# Altium project Arduino - FPGA Development Board.PrjPcb (part 1 of 2)
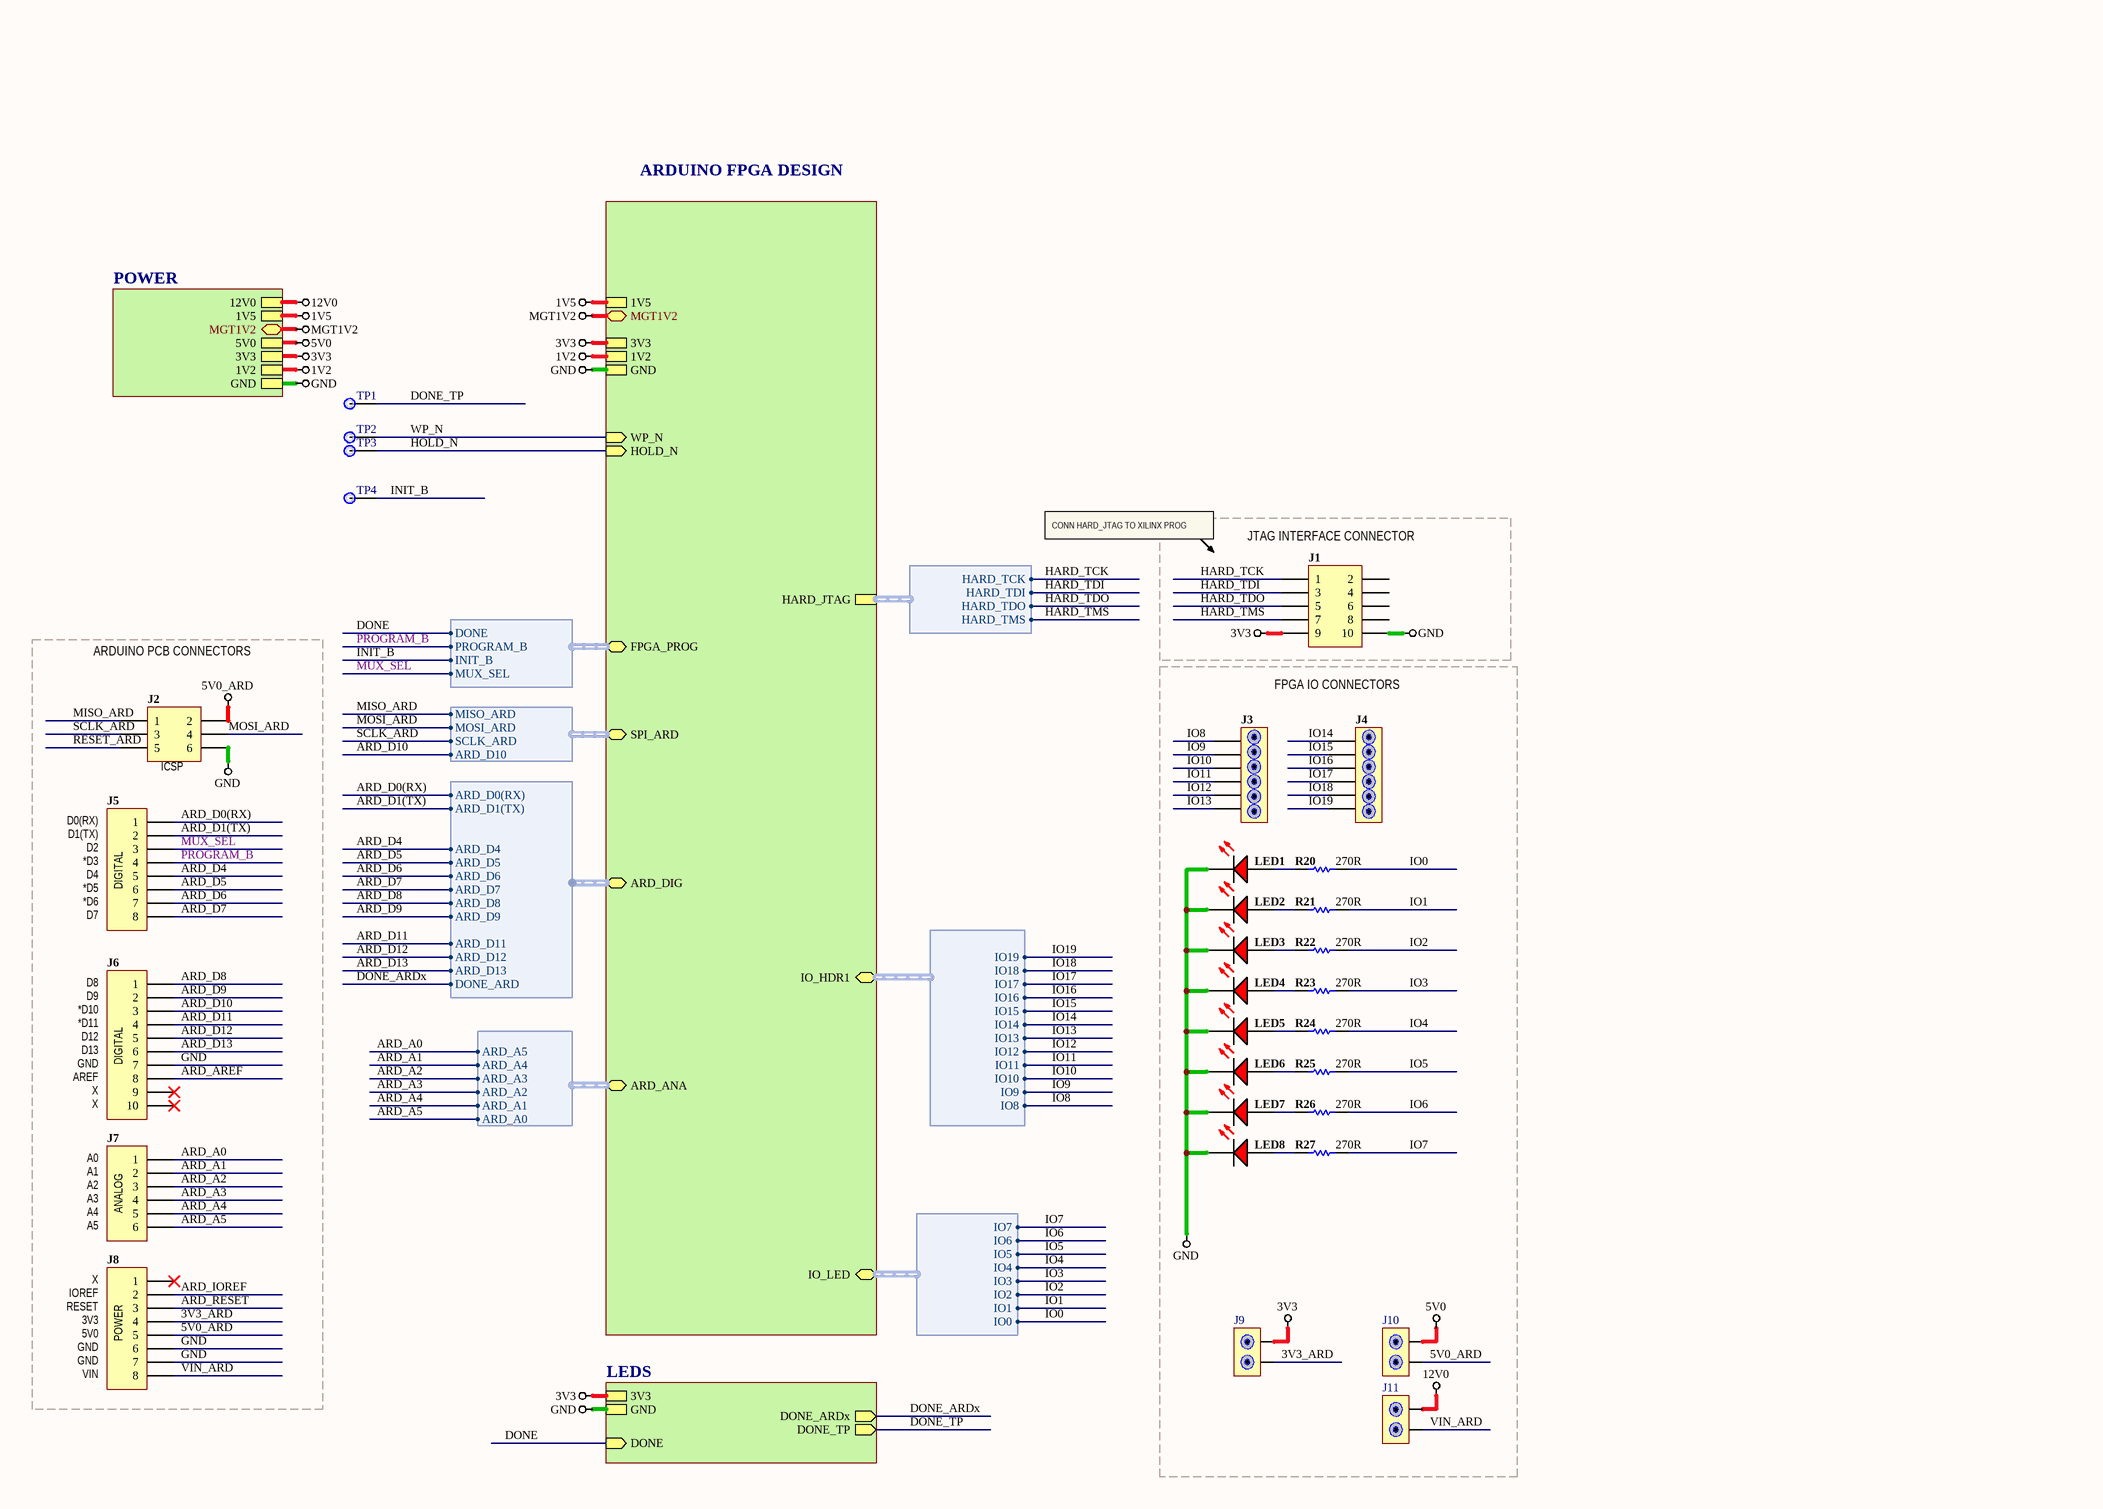
[diagram p0: Arduino FPGA Top-Level Interface.SchDoc]
15 sheets, 162 parts. Net scope: global (net labels, ports and power ports of the same name join across sheets).
Board file: Arduino_FPGA_Shield.PcbDoc
Sheets:
  Arduino FPGA Top-Level Interface.SchDoc
    ARDUINO FPGA DESIGN = Arduino FPGA Design.SchDoc
      FLASH_MEMORY = Flash - M25P32-VMW6TG.SchDoc
      FPGA_SUBSYSTEM = FPGA - XC6SLX45T-2CSG324C.schdoc
        U_FPGA - Decoupling = FPGA - Decoupling.SchDoc
      SPI MUX = Arduino FPGA SPI MUX.SchDoc
      SRAM = SRAM0 - IS61WV12816DBLL-10BLI.SchDoc
      MINI-PCIE = PCIE - mini-pcie-connector.SchDoc
      Designator = GPS - NEO-M8T.SchDoc
    POWER = Power.SchDoc
      Power - 5V0 = Power - 5V0.SchDoc
      Designator = Power - 3V3.SchDoc
      Designator = Power - MGT1V2.SchDoc
      Designator = Power - 1V5.SchDoc
    LEDS = LEDS - Status.SchDoc

## Sheet Arduino FPGA Top-Level Interface.SchDoc
size A3

### Parts
J1  Header 5X2  [HDR2X5]  (value not drawn)
J2  Header 3X2  [2X03]  (value not drawn)
J3  6-POS VERTICAL HEADER  [HDR1X6]  (value not drawn)
J4  6-POS VERTICAL HEADER  [HDR1X6]  (value not drawn)
J5  Header 8  [1X08]  (value not drawn)
J6  Header 10  [1X10@1]  (value not drawn)
J7  Header 6  [1X06]  (value not drawn)
J8  Header 8  [1X08]  (value not drawn)
J9  Jumper  [JMP1X2]  (value not drawn)
J10  Jumper  [JMP1X2]  (value not drawn)
J11  Jumper  [JMP1X2]  (value not drawn)
LED1  0402-LED-RED  [LED_0402]  (value not drawn)
LED2  0402-LED-RED  [LED_0402]  (value not drawn)
LED3  0402-LED-RED  [LED_0402]  (value not drawn)
LED4  0402-LED-RED  [LED_0402]  (value not drawn)
LED5  0402-LED-RED  [LED_0402]  (value not drawn)
LED6  0402-LED-RED  [LED_0402]  (value not drawn)
LED7  0402-LED-RED  [LED_0402]  (value not drawn)
LED8  0402-LED-RED  [LED_0402]  (value not drawn)
R20  value 270R  [RESC0402(1005)40_L]  (hidden comment: 270R 1 0402)
R21  value 270R  [RESC0402(1005)40_L]  (hidden comment: 270R 1 0402)
R22  value 270R  [RESC0402(1005)40_L]  (hidden comment: 270R 1 0402)
R23  value 270R  [RESC0402(1005)40_L]  (hidden comment: 270R 1 0402)
R24  value 270R  [RESC0402(1005)40_L]  (hidden comment: 270R 1 0402)
R25  value 270R  [RESC0402(1005)40_L]  (hidden comment: 270R 1 0402)
R26  value 270R  [RESC0402(1005)40_L]  (hidden comment: 270R 1 0402)
R27  value 270R  [RESC0402(1005)40_L]  (hidden comment: 270R 1 0402)
TP1  TESTPOINT_TH  [TESTPOINT_TH]  (value not drawn)
TP2  TESTPOINT_TH  [TESTPOINT_TH]  (value not drawn)
TP3  TESTPOINT_TH  [TESTPOINT_TH]  (value not drawn)
TP4  TESTPOINT_TH  [TESTPOINT_TH]  (value not drawn)

### Blocks framed on the sheet
JTAG INTERFACE CONNECTOR: J1
ARDUINO PCB CONNECTORS: J2 J5-J8
FPGA IO CONNECTORS: J3 J4 J9-J11 LED1-LED8 R20-R27

### Sub-sheets
ARDUINO FPGA DESIGN = Arduino FPGA Design.SchDoc: 3V3, GND, 1V2, HARD_JTAG (harness HARD_JTAG), WP_N (in), HOLD_N (in), FPGA_PROG (harness FPGA_PROGRAM), SPI_ARD (harness SPI_ARD), ARD_DIG (harness ARD_DIG), MGT1V2, 1V5, ARD_ANA (harness ARD_ANA), IO_HDR1 (harness IO_HDR1), IO_LED (harness IO_LED)
LEDS = LEDS - Status.SchDoc: GND, DONE (in), DONE_ARDx (out), DONE_TP (out), 3V3
POWER = Power.SchDoc: 5V0, 3V3, 1V2, GND, 1V5, MGT1V2, 12V0

### Harnesses
HARD_JTAG: HARD_TCK, HARD_TDI, HARD_TDO, HARD_TMS
FPGA_PROGRAM: INIT_B, PROGRAM_B, DONE, MUX_SEL
SPI_ARD: MISO_ARD, MOSI_ARD, SCLK_ARD, ARD_D10
ARD_DIG: ARD_D0(RX), ARD_D1(TX), ARD_D4, ARD_D5, ARD_D6, ARD_D7, ARD_D8, ARD_D9, ARD_D11, ARD_D12, ARD_D13, DONE_ARD
ARD_ANA: ARD_A0, ARD_A1, ARD_A2, ARD_A3, ARD_A4, ARD_A5
IO_LED: IO0, IO1, IO2, IO3, IO4, IO5, IO6, IO7
IO_HDR1: IO12, IO13, IO16, IO17, IO18, IO19, IO14, IO15, IO8, IO9, IO10, IO11

### Nets
1V2: sheet ARDUINO FPGA DESIGN/1V2, sheet POWER/1V2
1V5: sheet ARDUINO FPGA DESIGN/1V5, sheet POWER/1V5
3V3: J1.9 J9.2 ; sheet ARDUINO FPGA DESIGN/3V3, sheet POWER/3V3, sheet LEDS/3V3
5V0: J10.2 ; sheet POWER/5V0
5V0_ARD: J8.5 J10.1
12V0: J11.2 ; sheet POWER/12V0
GND: J1.10 J2.6 J6.7 J8.6 J8.7 LED1.2(K) LED2.2(K) LED3.2(K) LED4.2(K) LED5.2(K) LED6.2(K) LED7.2(K) LED8.2(K) ; sheet ARDUINO FPGA DESIGN/GND, sheet POWER/GND, sheet LEDS/GND  [project net AGND]
MGT1V2: sheet ARDUINO FPGA DESIGN/MGT1V2, sheet POWER/MGT1V2
3V3_ARD: J8.4 J9.1
ARD_A0: J7.1 ; sheet ARDUINO FPGA DESIGN/ARD_ANA.ARD_A5
ARD_A1: J7.2 ; sheet ARDUINO FPGA DESIGN/ARD_ANA.ARD_A4
ARD_A2: J7.3 ; sheet ARDUINO FPGA DESIGN/ARD_ANA.ARD_A3
ARD_A3: J7.4 ; sheet ARDUINO FPGA DESIGN/ARD_ANA.ARD_A2
ARD_A4: J7.5 ; sheet ARDUINO FPGA DESIGN/ARD_ANA.ARD_A1
ARD_A5: J7.6 ; sheet ARDUINO FPGA DESIGN/ARD_ANA.ARD_A0
ARD_AREF: J6.8
ARD_D0(RX): J5.1 ; sheet ARDUINO FPGA DESIGN/ARD_DIG.ARD_D0(RX)
ARD_D1(TX): J5.2 ; sheet ARDUINO FPGA DESIGN/ARD_DIG.ARD_D1(TX)
ARD_D4: J5.5 ; sheet ARDUINO FPGA DESIGN/ARD_DIG.ARD_D4
ARD_D5: J5.6 ; sheet ARDUINO FPGA DESIGN/ARD_DIG.ARD_D5
ARD_D6: J5.7 ; sheet ARDUINO FPGA DESIGN/ARD_DIG.ARD_D6
ARD_D7: J5.8 ; sheet ARDUINO FPGA DESIGN/ARD_DIG.ARD_D7
ARD_D8: J6.1 ; sheet ARDUINO FPGA DESIGN/ARD_DIG.ARD_D8
ARD_D9: J6.2 ; sheet ARDUINO FPGA DESIGN/ARD_DIG.ARD_D9
ARD_D10: J6.3 ; sheet ARDUINO FPGA DESIGN/SPI_ARD.ARD_D10
ARD_D11: J6.4 ; sheet ARDUINO FPGA DESIGN/ARD_DIG.ARD_D11
ARD_D12: J6.5 ; sheet ARDUINO FPGA DESIGN/ARD_DIG.ARD_D12
ARD_D13: J6.6 ; sheet ARDUINO FPGA DESIGN/ARD_DIG.ARD_D13
ARD_IOREF: J8.2
ARD_RESET: J8.3
DONE: sheet LEDS/DONE, sheet ARDUINO FPGA DESIGN/FPGA_PROG.DONE
DONE_ARDx: sheet LEDS/DONE_ARDx, sheet ARDUINO FPGA DESIGN/ARD_DIG.DONE_ARD
DONE_TP: TP1.1 ; sheet LEDS/DONE_TP
HARD_TCK: J1.1 ; sheet ARDUINO FPGA DESIGN/HARD_JTAG.HARD_TCK
HARD_TDI: J1.3 ; sheet ARDUINO FPGA DESIGN/HARD_JTAG.HARD_TDI
HARD_TDO: J1.5 ; sheet ARDUINO FPGA DESIGN/HARD_JTAG.HARD_TDO
HARD_TMS: J1.7 ; sheet ARDUINO FPGA DESIGN/HARD_JTAG.HARD_TMS
HOLD_N: TP3.1 ; sheet ARDUINO FPGA DESIGN/HOLD_N
INIT_B: TP4.1 ; sheet ARDUINO FPGA DESIGN/FPGA_PROG.INIT_B
IO0: R20.2 ; sheet ARDUINO FPGA DESIGN/IO_LED.IO0
IO1: R21.2 ; sheet ARDUINO FPGA DESIGN/IO_LED.IO1
IO2: R22.2 ; sheet ARDUINO FPGA DESIGN/IO_LED.IO2
IO3: R23.2 ; sheet ARDUINO FPGA DESIGN/IO_LED.IO3
IO4: R24.2 ; sheet ARDUINO FPGA DESIGN/IO_LED.IO4
IO5: R25.2 ; sheet ARDUINO FPGA DESIGN/IO_LED.IO5
IO6: R26.2 ; sheet ARDUINO FPGA DESIGN/IO_LED.IO6
IO7: R27.2 ; sheet ARDUINO FPGA DESIGN/IO_LED.IO7
IO8: J3.1 ; sheet ARDUINO FPGA DESIGN/IO_HDR1.IO8
IO9: J3.2 ; sheet ARDUINO FPGA DESIGN/IO_HDR1.IO9
IO10: J3.3 ; sheet ARDUINO FPGA DESIGN/IO_HDR1.IO10
IO11: J3.4 ; sheet ARDUINO FPGA DESIGN/IO_HDR1.IO11
IO12: J3.5 ; sheet ARDUINO FPGA DESIGN/IO_HDR1.IO12
IO13: J3.6 ; sheet ARDUINO FPGA DESIGN/IO_HDR1.IO13
IO14: J4.1 ; sheet ARDUINO FPGA DESIGN/IO_HDR1.IO14
IO15: J4.2 ; sheet ARDUINO FPGA DESIGN/IO_HDR1.IO15
IO16: J4.3 ; sheet ARDUINO FPGA DESIGN/IO_HDR1.IO16
IO17: J4.4 ; sheet ARDUINO FPGA DESIGN/IO_HDR1.IO17
IO18: J4.5 ; sheet ARDUINO FPGA DESIGN/IO_HDR1.IO18
IO19: J4.6 ; sheet ARDUINO FPGA DESIGN/IO_HDR1.IO19
MISO_ARD: J2.1 ; sheet ARDUINO FPGA DESIGN/SPI_ARD.MISO_ARD
MOSI_ARD: J2.4 ; sheet ARDUINO FPGA DESIGN/SPI_ARD.MOSI_ARD
MUX_SEL: J5.3 ; sheet ARDUINO FPGA DESIGN/FPGA_PROG.MUX_SEL
PROGRAM_B: J5.4 ; sheet ARDUINO FPGA DESIGN/FPGA_PROG.PROGRAM_B
RESET_ARD: J2.5
SCLK_ARD: J2.3 ; sheet ARDUINO FPGA DESIGN/SPI_ARD.SCLK_ARD
VIN_ARD: J8.8 J11.1
WP_N: TP2.1 ; sheet ARDUINO FPGA DESIGN/WP_N
NetLED1_1: LED1.1(A) R20.1
NetLED2_1: LED2.1(A) R21.1
NetLED3_1: LED3.1(A) R22.1
NetLED4_1: LED4.1(A) R23.1
NetLED5_1: LED5.1(A) R24.1
NetLED6_1: LED6.1(A) R25.1
NetLED7_1: LED7.1(A) R26.1
NetLED8_1: LED8.1(A) R27.1

Not connected (* = marked no-connect by the designer): J1 2 4 6 8; J2 2; J6 9* 10*; J8 1*

### Notes on the sheet
- CONN HARD_JTAG TO XILINX PROG
- (near J2) ICSP
- (near J5) D0(RX)
- (near J5) D1(TX)
- (near J5) D2
- (near J5) *D3
- (near J5) D4
- (near J5) *D5
- (near J5) *D6
- (near J5) D7
- (near J5) DIGITAL
- (near J6) D8
- (near J6) D9
- (near J6) *D10
- (near J6) *D11
- (near J6) D12
- (near J6) D13
- (near J6) GND
- (near J6) AREF
- (near J6) X
- X
- (near J6) DIGITAL
- A0
- (near J7) A1
- (near J7) A2
- (near J7) A3
- (near J7) A4
- A5
- (near J7) ANALOG
- (near J8) IOREF
- (near J8) RESET
- (near J8) 3V3
- (near J8) 5V0
- (near J8) GND
- (near J8) VIN
- (near J8) POWER
- Labels drawn without touching a wire or pin: 5V0_ARD

### Library data of the parts
J1 = Header 5X2: Header, 5-Pin, Dual row; Manufacturer_PN: 67997-210HLF; LatestRevisionDate: 17-Jul-2002; LatestRevisionNote: Re-released for DXP Platform.; Publisher: Altium Limited; Manufacturer Part Number: 67997-210HLF
J2 = Header 3X2: Header, 3-Pin, Dual row; Manufacturer_PN: DNP; LatestRevisionDate: 17-Jul-2002; LatestRevisionNote: Re-released for DXP Platform.; Publisher: Altium Limited; Manufacturer Part Number: DNP
J3 J4 = 6-POS-HDR: Manufacturer_PN: 68000-406HLF; Manufacturer Part Number: 68000-406HLF
J5 J8 = Header 8: Header, 8-Pin; Manufacturer_PN: DNP; LatestRevisionDate: 17-Jul-2002; LatestRevisionNote: Re-released for DXP Platform.; Publisher: Altium Limited; Manufacturer Part Number: DNP
J6 = Header 10: Header, 10-Pin; Manufacturer_PN: DNP; LatestRevisionDate: 17-Jul-2002; LatestRevisionNote: Re-released for DXP Platform.; Publisher: Altium Limited; Manufacturer Part Number: DNP
J7 = Header 6: Header, 6-Pin; Manufacturer_PN: DNP; LatestRevisionDate: 17-Jul-2002; LatestRevisionNote: Re-released for DXP Platform.; Publisher: Altium Limited; Manufacturer Part Number: DNP
J9-J11 = JMP1X2: Standard 2 Pin Jumper, 100mil spacing; Manufacturer_PN: M20-9770246; Manufacturer Part Number: M20-9770246
LED1-LED8 = CMP-0201-0013: 0402 LED,RED; Manufacturer_PN: LTST-C190KRKT; DefaultDesignator: LED?; Class: Diodes; Current Average (Io): 1.8V; ID: CMP-0201-0013; Sub Class: LED; Reverse Voltage DC (Vr): Red; ComponentLink1Description: Datasheet; ComponentLink1URL: http://optoelectronics.liteon.com/upload/download/DS-22-99-0151/S_110_LTST-C190KRKT.pdf; ComponentLink2Description: Manufacturer; ComponentLink2URL: http://www.liteon.com; Manufacturer Part Number: LTST-C190KRKT
R20-R27 = CMP-0503-0059: 0402 (1005 Metric) 1/16 W 270R 1 Thick Film Chip Resistor; Manufacturer_PN: RC1005F271CS; Case-EIA: 0402; Case-Metric: 1005; Temp Coefficient ppm/°C: ±100; Tolerance %: 1%; Value (Ohms): 270; Power: 1/16 W; ID: CMP-0503-0059; Technology: SMT; Manufacturer Part Number: RC1005F271CS
TP1-TP4 = TESTPOINT_TH: Manufacturer_PN: TESTPOINT; Manufacturer Part Number: TESTPOINT

## Sheet Arduino FPGA Design.SchDoc
size A3
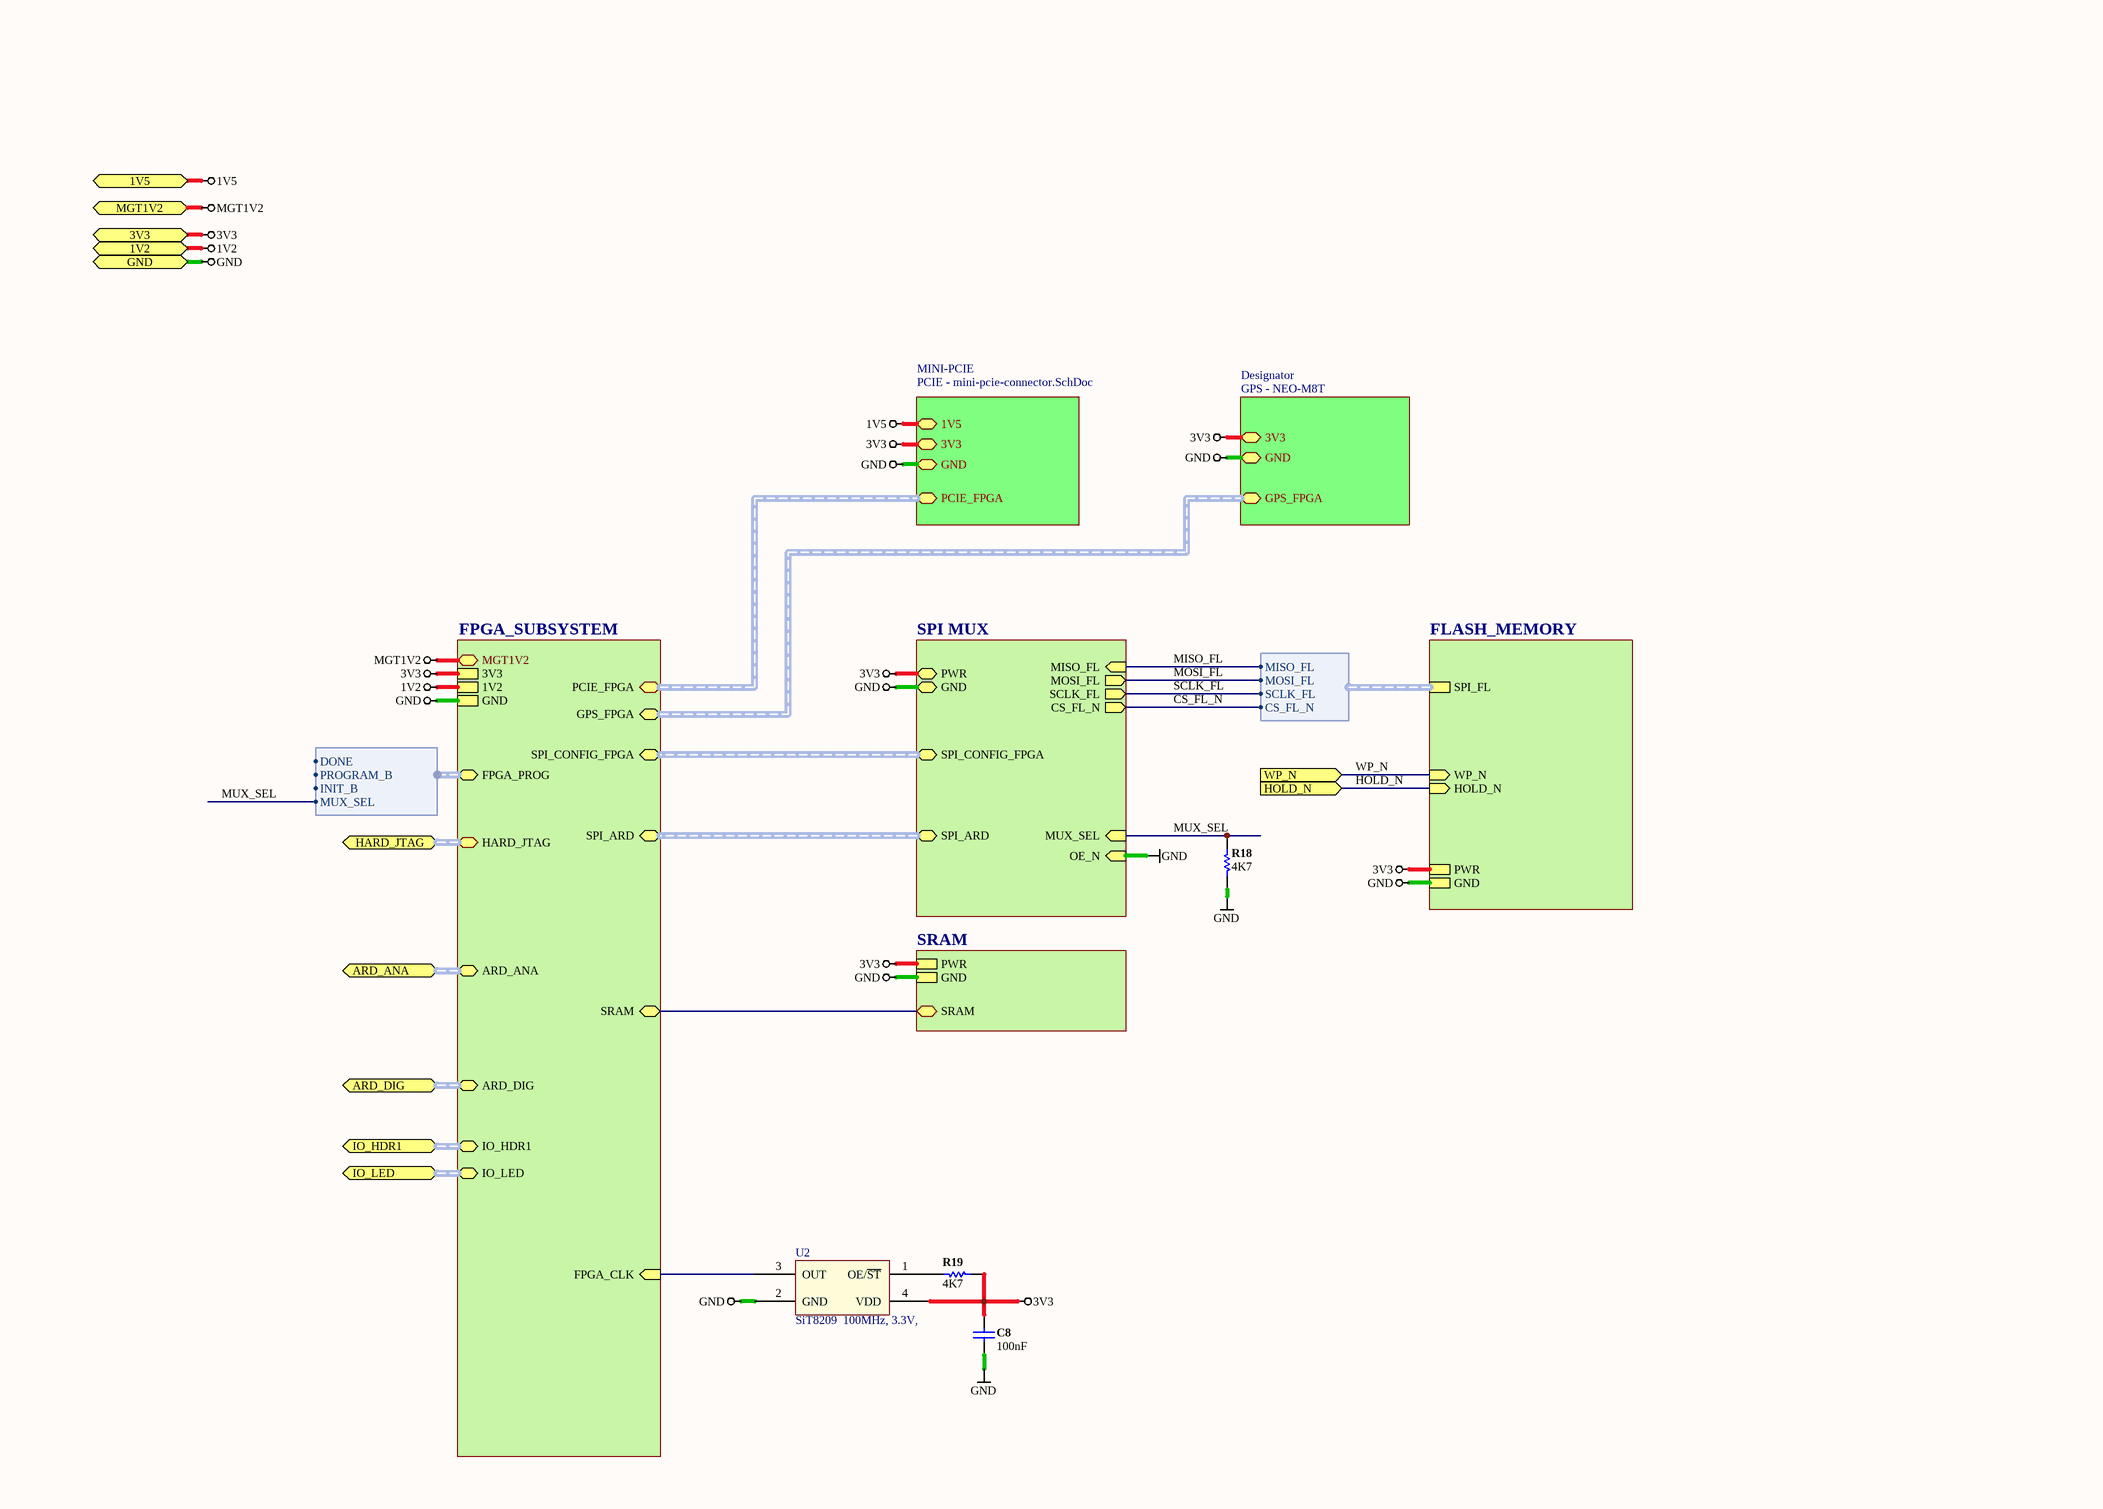
[diagram p1: Arduino FPGA Design.SchDoc]

### Parts
C8  value 100nF  [CAPC0402(1005)60_L]  (hidden comment: CAP 100nF 16V 0402(1005))
R18  value 4K7  [RESC0402(1005)40_L]  (hidden comment: 4K7 1 0402)
R19  value 4K7  [RESC0402(1005)40_L]  (hidden comment: 4K7 1 0402)
U2  SiT8209  100MHz, 3.3V,

### Sub-sheets
Designator = GPS - NEO-M8T: GPS_FPGA (harness GPS_FPGA), 3V3, GND
FLASH_MEMORY = Flash - M25P32-VMW6TG.SchDoc: SPI_FL (harness SPI_FLASH), PWR, WP_N (in), HOLD_N (in), GND
FPGA_SUBSYSTEM = FPGA - XC6SLX45T-2CSG324C.schdoc: 3V3, GND, 1V2, FPGA_CLK (in), HARD_JTAG (harness HARD_JTAG), SPI_CONFIG_FPGA (harness SPI_CONFIG_FPGA), FPGA_PROG (harness FPGA_PROGRAM), SRAM (harness SRAM), PCIE_FPGA (harness PCIE_FPGA), MGT1V2, GPS_FPGA (harness GPS_FPGA), ARD_DIG (harness ARD_DIG), ARD_ANA (harness ARD_ANA), SPI_ARD (harness SPI_ARD), IO_HDR1 (harness IO_HDR1), IO_LED (harness IO_LED)
MINI-PCIE = PCIE - mini-pcie-connector.SchDoc: PCIE_FPGA (harness PCIE_FPGA), 1V5, 3V3, GND
SPI MUX = Arduino FPGA SPI MUX.SchDoc: MISO_FL (in), MOSI_FL (out), SCLK_FL (out), CS_FL_N (out), OE_N (in), MUX_SEL (in), SPI_CONFIG_FPGA (harness SPI_CONFIG_FPGA), PWR, GND, SPI_ARD (harness SPI_ARD)
SRAM = SRAM0 - IS61WV12816DBLL-10BLI.SchDoc: PWR, GND, SRAM (harness SRAM)

### Ports
1V2, 1V5, 3V3, ARD_ANA (harness ARD_ANA), ARD_DIG (harness ARD_DIG), GND, HARD_JTAG (harness HARD_JTAG), HOLD_N (in), IO_HDR1 (harness IO_HDR1), IO_LED (harness IO_LED), MGT1V2, WP_N (in)

### Harnesses
SPI_FLASH: MOSI_FL, MISO_FL, SCLK_FL, CS_FL_N
FPGA_PROGRAM: INIT_B, PROGRAM_B, DONE, MUX_SEL

### Nets
1V2: port 1V2, sheet FPGA_SUBSYSTEM/1V2
1V5: port 1V5, sheet MINI-PCIE/1V5
3V3: C8.1 R19.2 U2.4(VDD) ; port 3V3, sheet FLASH_MEMORY/PWR, sheet FPGA_SUBSYSTEM/3V3, sheet SPI MUX/PWR, sheet SRAM/PWR, sheet MINI-PCIE/3V3, sheet Designator/3V3
GND: C8.2 R18.1 U2.2(GND) ; port GND, sheet FLASH_MEMORY/GND, sheet FPGA_SUBSYSTEM/GND, sheet SPI MUX/OE_N, sheet SPI MUX/GND, sheet SRAM/GND, sheet MINI-PCIE/GND, sheet Designator/GND  [project net AGND]
MGT1V2: port MGT1V2, sheet FPGA_SUBSYSTEM/MGT1V2
CS_FL_N: sheet SPI MUX/CS_FL_N, sheet FLASH_MEMORY/SPI_FL.CS_FL_N
HOLD_N: port HOLD_N, sheet FLASH_MEMORY/HOLD_N
MISO_FL: sheet SPI MUX/MISO_FL, sheet FLASH_MEMORY/SPI_FL.MISO_FL
MOSI_FL: sheet SPI MUX/MOSI_FL, sheet FLASH_MEMORY/SPI_FL.MOSI_FL
MUX_SEL: R18.2 ; sheet SPI MUX/MUX_SEL, sheet FPGA_SUBSYSTEM/FPGA_PROG.MUX_SEL
SCLK_FL: sheet SPI MUX/SCLK_FL, sheet FLASH_MEMORY/SPI_FL.SCLK_FL
WP_N: port WP_N, sheet FLASH_MEMORY/WP_N
NetR19_1: R19.1 U2.1(OE/~{ST})
NetU2_3: U2.3(OUT) ; sheet FPGA_SUBSYSTEM/FPGA_CLK

### Buses and harness runs
harness port ARD_ANA = sheet FPGA_SUBSYSTEM/ARD_ANA
harness port ARD_DIG = sheet FPGA_SUBSYSTEM/ARD_DIG
harness port HARD_JTAG = sheet FPGA_SUBSYSTEM/HARD_JTAG
harness port IO_HDR1 = sheet FPGA_SUBSYSTEM/IO_HDR1
harness port IO_LED = sheet FPGA_SUBSYSTEM/IO_LED
harness sheet Designator/GPS_FPGA = sheet FPGA_SUBSYSTEM/GPS_FPGA
harness sheet FPGA_SUBSYSTEM/PCIE_FPGA = sheet MINI-PCIE/PCIE_FPGA
harness sheet FPGA_SUBSYSTEM/SPI_ARD = sheet SPI MUX/SPI_ARD
harness sheet FPGA_SUBSYSTEM/SPI_CONFIG_FPGA = sheet SPI MUX/SPI_CONFIG_FPGA

### Library data of the parts
C8 = CAP 100nF 16V ±10% 0402 (1005 Metric) Thickness 0.6mm SMD: Manufacturer_PN: C0402C104K8PACTU; Case-EIA: 0402; Case-Metric: 1005; Tolerance: ±10%; Max Thickness: 0.6 mm; Rated Voltage: 16 V; Technology: SMT; Manufacturer Part Number: C0402C104K8PACTU
R18 R19 = 0402 (1005 Metric) 1/16 W 4K7 1 Thick Film Chip Resistor: Manufacturer_PN: CR0402-FX-4701GLFDKR-ND; Case-EIA: 0402; Case-Metric: 1005; Power: 1/16 W; Temp Coefficient ppm/°C: ±100; Tolerance %: 1%; Value (Ohms): 4700; Technology: SMT; Manufacturer Part Number: CR0402-FX-4701GLFDKR-ND
U2 = SiT8209

## Sheet Flash - M25P32-VMW6TG.SchDoc
size A4; minSupply: 2V4; maxSupply: 3V7
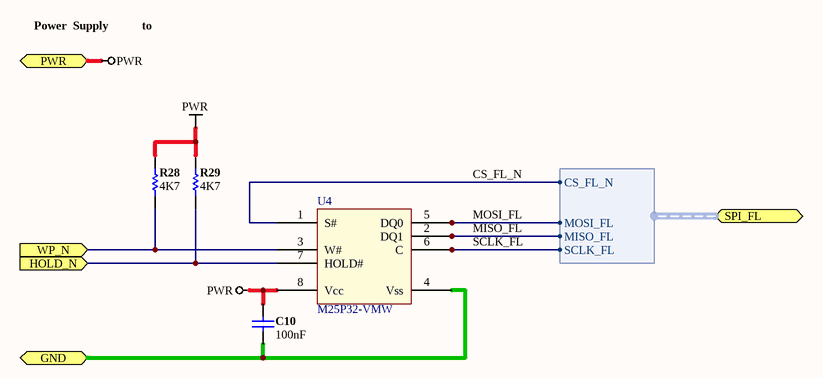
[diagram p2: Flash - M25P32-VMW6TG.SchDoc]

### Parts
C10  value 100nF  [CAPC0402(1005)60_L]  (hidden comment: CAP 100nF 16V 0402(1005))
R28  4K7  [RESC0402(1005)40_L]
R29  4K7  [RESC0402(1005)40_L]
U4  M25P32-VMW  [SOIC-8W]

### Ports
GND, HOLD_N (in), PWR, SPI_FL (harness SPI_FLASH), WP_N (in)

### Harnesses
SPI_FLASH: MOSI_FL, MISO_FL, SCLK_FL, CS_FL_N

### Nets
AGND: C10.2 U4.4(Vss) ; port GND
PWR: C10.1 R28.2 R29.2 U4.8(Vcc) ; port PWR
CS_FL_N: U4.1(S#) ; port SPI_FL.CS_FL_N
HOLD_N: R29.1 U4.7(HOLD#) ; port HOLD_N
MISO_FL: U4.2(DQ1) ; port SPI_FL.MISO_FL
MOSI_FL: U4.5(DQ0) ; port SPI_FL.MOSI_FL
SCLK_FL: U4.6(C) ; port SPI_FL.SCLK_FL
WP_N: R28.1 U4.3(W#) ; port WP_N

### Notes on the sheet
- Power  Supply
- to

### Library data of the parts
C10 = CAP 100nF 16V ±10% 0402 (1005 Metric) Thickness 0.6mm SMD: as C8 on sheet Arduino FPGA Design; Max Thickness: 0.6 mm; Rated Voltage: 16 V; Technology: SMT; Manufacturer Part Number: C0402C104K8PACTU
R28 R29 = 0402 (1005 Metric) 1/16 W 4K7 1 Thick Film Chip Resistor: Manufacturer_PN: CR0402-FX-4701GLFDKR-ND; Case-EIA: 0402; Case-Metric: 1005; Temp Coefficient ppm/°C: ±100; Tolerance %: 1%; Value (Ohms): 4700; Power: 1/16 W; Value: 4K7; Technology: SMT; Manufacturer Part Number: CR0402-FX-4701GLFDKR-ND
U4 = M25P32-VMW6TG

## Sheet FPGA - XC6SLX45T-2CSG324C.schdoc
size D
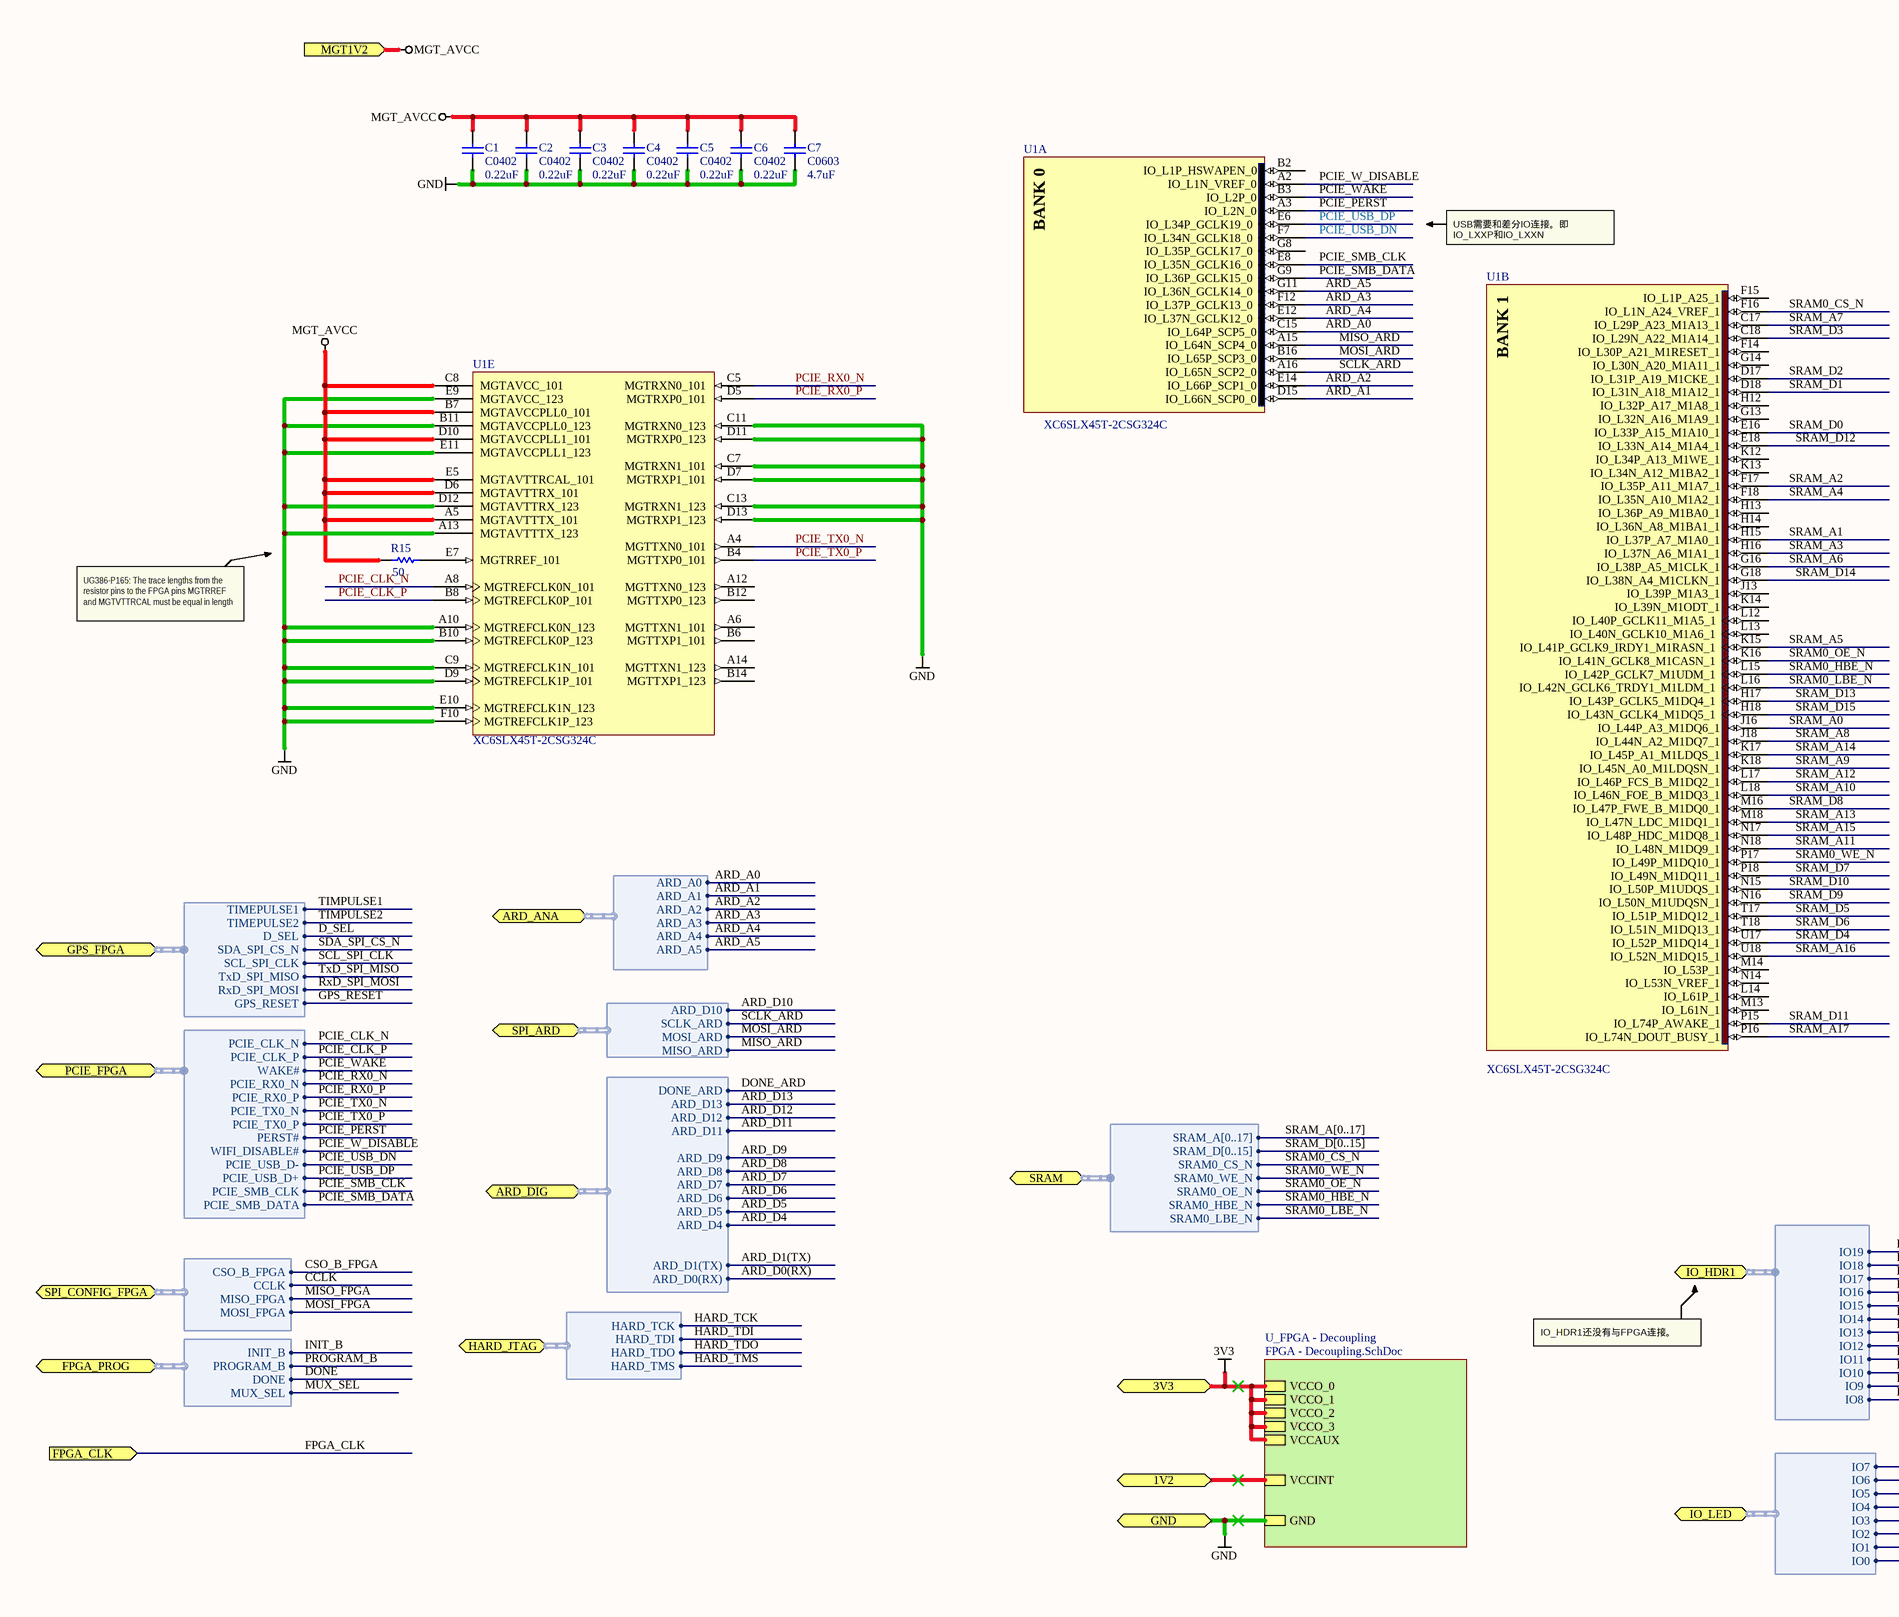
[diagram p3: FPGA - XC6SLX45T-2CSG324C.schdoc, left]
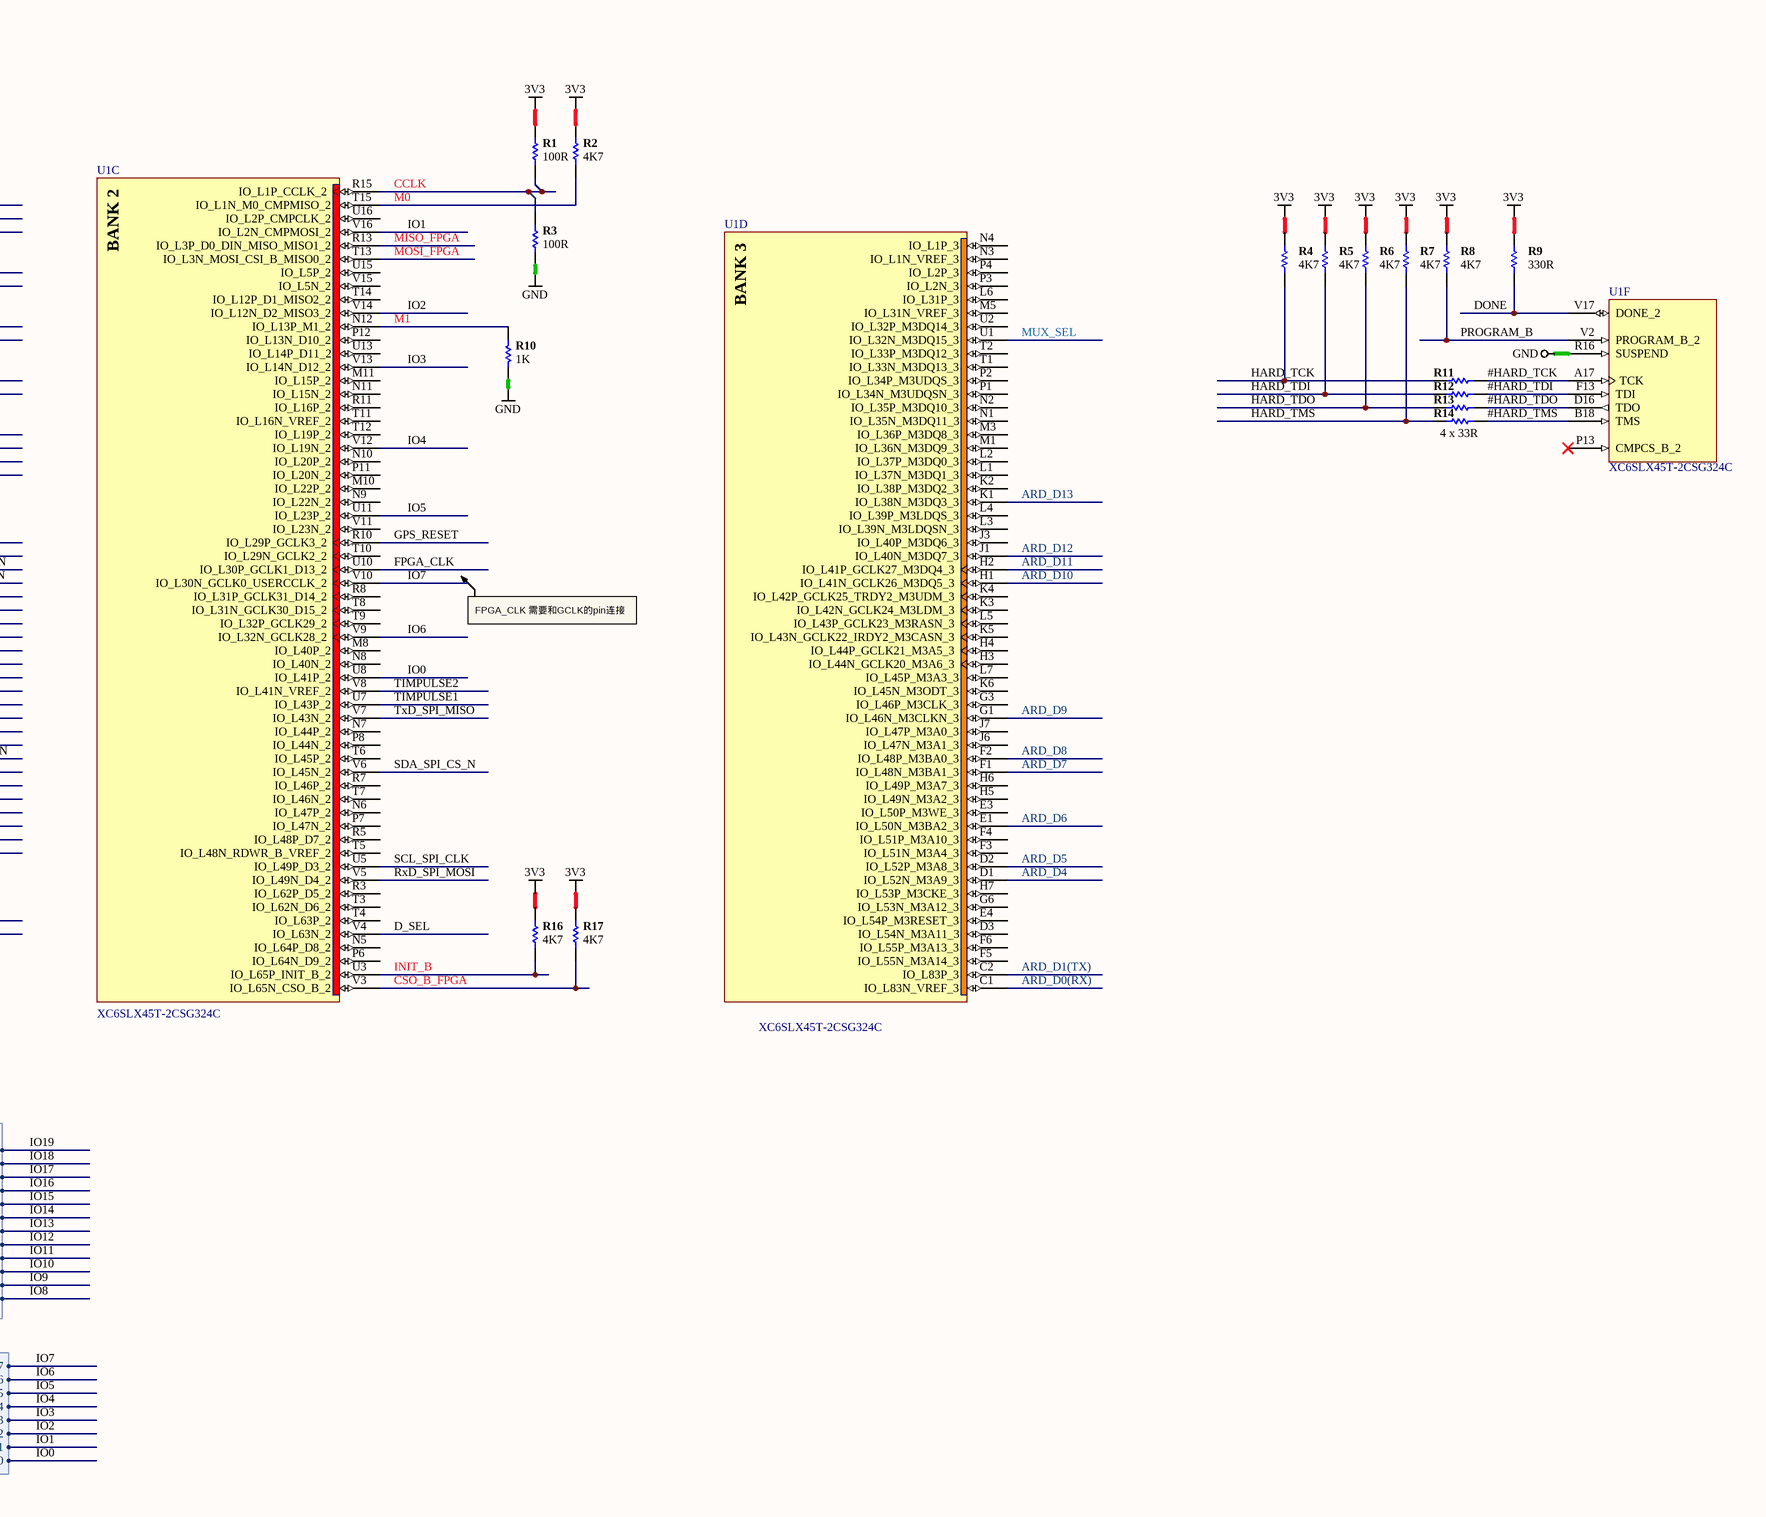
[diagram p4: FPGA - XC6SLX45T-2CSG324C.schdoc, right]

### Parts
C1  C0402  value 0.22uF  [CAPC0402(1005)60_L]
C2  C0402  value 0.22uF  [CAPC0402(1005)60_L]
C3  C0402  value 0.22uF  [CAPC0402(1005)60_L]
C4  C0402  value 0.22uF  [CAPC0402(1005)60_L]
C5  C0402  value 0.22uF  [CAPC0402(1005)60_L]
C6  C0402  value 0.22uF  [CAPC0402(1005)60_L]
C7  C0603  value 4.7uF  [CAPC0603(1608)55_L]
R1  value 100R  [RESC0402(1005)40_L]  (hidden comment: 100R 1 0402)
R2  value 4K7  [RESC0402(1005)40_L]  (hidden comment: 4K7 1 0402)
R3  value 100R  [RESC0402(1005)40_L]  (hidden comment: 100R 1 0402)
R4  value 4K7  [RESC0402(1005)40_L]  (hidden comment: 4K7 1 0402)
R5  value 4K7  [RESC0402(1005)40_L]  (hidden comment: 4K7 1 0402)
R6  value 4K7  [RESC0402(1005)40_L]  (hidden comment: 4K7 1 0402)
R7  value 4K7  [RESC0402(1005)40_L]  (hidden comment: 4K7 1 0402)
R8  value 4K7  [RESC0402(1005)40_L]  (hidden comment: 4K7 1 0402)
R9  value 330R  [RESC0402(1005)40_L]  (hidden comment: 330R 1 0402)
R10  value 1K  [RESC0402(1005)40_L]  (hidden comment: 1K 1 0402)
R11  33R 1 0402  [RESC0402(1005)40_L]  (value not drawn)
R12  33R 1 0402  [RESC0402(1005)40_L]  (value not drawn)
R13  33R 1 0402  [RESC0402(1005)40_L]  (value not drawn)
R14  33R 1 0402  [RESC0402(1005)40_L]  (value not drawn)
R15  value 50  [RESC0402(1005)40_L]  (hidden comment: Res1)
R16  value 4K7  [RESC0402(1005)40_L]  (hidden comment: 4K7 1 0402)
R17  value 4K7  [RESC0402(1005)40_L]  (hidden comment: 4K7 1 0402)
U1  XC6SLX45T-2CSG324C  [CSG324]  (parts A,B,C,D,E,F of 8)

### Sub-sheets
U_FPGA - Decoupling = FPGA - Decoupling.SchDoc: VCCO_0, VCCO_3, VCCO_1, VCCO_2, VCCAUX, VCCINT, GND

### Ports
1V2, 3V3, ARD_ANA (harness ARD_ANA), ARD_DIG (harness ARD_DIG), FPGA_CLK (in), FPGA_PROG (harness FPGA_PROGRAM), GND, GPS_FPGA (harness GPS_FPGA), HARD_JTAG (harness HARD_JTAG), IO_HDR1 (harness IO_HDR1), IO_LED (harness IO_LED), MGT1V2 (in), PCIE_FPGA (harness PCIE_FPGA), SPI_ARD (harness SPI_ARD), SPI_CONFIG_FPGA (harness SPI_CONFIG_FPGA), SRAM (harness SRAM)

### Harnesses
SPI_CONFIG_FPGA: CSO_B_FPGA, CCLK, MISO_FPGA, MOSI_FPGA
HARD_JTAG: HARD_TCK, HARD_TDI, HARD_TDO, HARD_TMS
FPGA_PROGRAM: INIT_B, PROGRAM_B, DONE, MUX_SEL
SRAM: SRAM_A[0..17], SRAM_D[0..15], SRAM0_CS_N, SRAM0_WE_N, SRAM0_OE_N, SRAM0_HBE_N, SRAM0_LBE_N
SPI_ARD: MISO_ARD, MOSI_ARD, SCLK_ARD, ARD_D10
ARD_DIG: ARD_D0(RX), ARD_D1(TX), ARD_D4, ARD_D5, ARD_D6, ARD_D7, ARD_D8, ARD_D9, ARD_D11, ARD_D12, ARD_D13, DONE_ARD
ARD_ANA: ARD_A0, ARD_A1, ARD_A2, ARD_A3, ARD_A4, ARD_A5
GPS_FPGA: TIMEPULSE1, TIMEPULSE2, SDA_SPI_CS_N, SCL_SPI_CLK, TxD_SPI_MISO, RxD_SPI_MOSI, D_SEL, GPS_RESET
IO_LED: IO0, IO1, IO2, IO3, IO4, IO5, IO6, IO7
IO_HDR1: IO12, IO13, IO16, IO17, IO18, IO19, IO14, IO15, IO8, IO9, IO10, IO11
PCIE_FPGA: PCIE_CLK_N, PCIE_CLK_P, PCIE_RX0_N, PCIE_RX0_P, PCIE_TX0_N, PCIE_TX0_P, PERST#, WIFI_DISABLE#, PCIE_USB_D-, PCIE_USB_D+, PCIE_SMB_CLK, PCIE_SMB_DATA, WAKE#

### Nets
1V2: port 1V2, sheet U_FPGA - Decoupling/VCCINT
3V3: R1.2 R2.2 R4.2 R5.2 R6.2 R7.2 R8.2 R9.2 R16.2 R17.2 ; port 3V3, sheet U_FPGA - Decoupling/VCCO_0, sheet U_FPGA - Decoupling/VCCO_3, sheet U_FPGA - Decoupling/VCCO_1, sheet U_FPGA - Decoupling/VCCO_2, sheet U_FPGA - Decoupling/VCCAUX
GND: C1.1 C2.1 C3.1 C4.1 C5.1 C6.1 C7.1 R3.1 R10.1 U1.A10(MGTREFCLK0N_123) U1.A13(MGTAVTTTX_123) U1.B10(MGTREFCLK0P_123) U1.B11(MGTAVCCPLL0_123) U1.C7(MGTRXN1_101) U1.C9(MGTREFCLK1N_101) U1.C11(MGTRXN0_123) U1.C13(MGTRXN1_123) U1.D7(MGTRXP1_101) U1.D9(MGTREFCLK1P_101) U1.D11(MGTRXP0_123) U1.D12(MGTAVTTRX_123) U1.D13(MGTRXP1_123) U1.E9(MGTAVCC_123) U1.E10(MGTREFCLK1N_123) U1.E11(MGTAVCCPLL1_123) U1.F10(MGTREFCLK1P_123) U1.R16(SUSPEND) ; port GND, sheet U_FPGA - Decoupling/GND  [project net AGND]
MGT_AVCC: C1.2 C2.2 C3.2 C4.2 C5.2 C6.2 C7.2 R15.1 U1.A5(MGTAVTTTX_101) U1.B7(MGTAVCCPLL0_101) U1.C8(MGTAVCC_101) U1.D6(MGTAVTTRX_101) U1.D10(MGTAVCCPLL1_101) U1.E5(MGTAVTTRCAL_101) ; port MGT1V2  [project net MGT1V2]
#HARD_TCK: R11.2 U1.A17(TCK)
#HARD_TDI: R12.2 U1.F13(TDI)
#HARD_TDO: R13.2 U1.D16(TDO)
#HARD_TMS: R14.2 U1.B18(TMS)
ARD_A0: U1.C15(IO_L64P_SCP5_0) ; port ARD_ANA.ARD_A0
ARD_A1: U1.D15(IO_L66N_SCP0_0) ; port ARD_ANA.ARD_A1
ARD_A2: U1.E14(IO_L66P_SCP1_0) ; port ARD_ANA.ARD_A2
ARD_A3: U1.F12(IO_L37P_GCLK13_0) ; port ARD_ANA.ARD_A3
ARD_A4: U1.E12(IO_L37N_GCLK12_0) ; port ARD_ANA.ARD_A4
ARD_A5: U1.G11(IO_L36N_GCLK14_0) ; port ARD_ANA.ARD_A5
ARD_D0(RX): U1.C1(IO_L83N_VREF_3) ; port ARD_DIG.ARD_D0(RX)
ARD_D1(TX): U1.C2(IO_L83P_3) ; port ARD_DIG.ARD_D1(TX)
ARD_D4: U1.D1(IO_L52N_M3A9_3) ; port ARD_DIG.ARD_D4
ARD_D5: U1.D2(IO_L52P_M3A8_3) ; port ARD_DIG.ARD_D5
ARD_D6: U1.E1(IO_L50N_M3BA2_3) ; port ARD_DIG.ARD_D6
ARD_D7: U1.F1(IO_L48N_M3BA1_3) ; port ARD_DIG.ARD_D7
ARD_D8: U1.F2(IO_L48P_M3BA0_3) ; port ARD_DIG.ARD_D8
ARD_D9: U1.G1(IO_L46N_M3CLKN_3) ; port ARD_DIG.ARD_D9
ARD_D10: U1.H1(IO_L41N_GCLK26_M3DQ5_3) ; port SPI_ARD.ARD_D10
ARD_D11: U1.H2(IO_L41P_GCLK27_M3DQ4_3) ; port ARD_DIG.ARD_D11
ARD_D12: U1.J1(IO_L40N_M3DQ7_3) ; port ARD_DIG.ARD_D12
ARD_D13: U1.K1(IO_L38N_M3DQ3_3) ; port ARD_DIG.ARD_D13
CCLK: R1.1 R3.2 U1.R15(IO_L1P_CCLK_2) ; port SPI_CONFIG_FPGA.CCLK
CSO_B_FPGA: R17.1 U1.V3(IO_L65N_CSO_B_2) ; port SPI_CONFIG_FPGA.CSO_B_FPGA
D_SEL: U1.V4(IO_L63N_2) ; port GPS_FPGA.D_SEL
DONE: R9.1 U1.V17(DONE_2) ; port FPGA_PROG.DONE
DONE_ARD: port ARD_DIG.DONE_ARD
FPGA_CLK: U1.U10(IO_L30P_GCLK1_D13_2) ; port FPGA_CLK
GPS_RESET: U1.R10(IO_L29P_GCLK3_2) ; port GPS_FPGA.GPS_RESET
HARD_TCK: R4.1 R11.1 ; port HARD_JTAG.HARD_TCK
HARD_TDI: R5.1 R12.1 ; port HARD_JTAG.HARD_TDI
HARD_TDO: R6.1 R13.1 ; port HARD_JTAG.HARD_TDO
HARD_TMS: R7.1 R14.1 ; port HARD_JTAG.HARD_TMS
INIT_B: R16.1 U1.U3(IO_L65P_INIT_B_2) ; port FPGA_PROG.INIT_B
IO0: U1.U8(IO_L41P_2) ; port IO_LED.IO0
IO1: U1.V16(IO_L2N_CMPMOSI_2) ; port IO_LED.IO1
IO2: U1.V14(IO_L12N_D2_MISO3_2) ; port IO_LED.IO2
IO3: U1.V13(IO_L14N_D12_2) ; port IO_LED.IO3
IO4: U1.V12(IO_L19N_2) ; port IO_LED.IO4
IO5: U1.U11(IO_L23P_2) ; port IO_LED.IO5
IO6: U1.V9(IO_L32N_GCLK28_2) ; port IO_LED.IO6
IO7: U1.V10(IO_L30N_GCLK0_USERCCLK_2) ; port IO_LED.IO7
M0: R2.1 U1.T15(IO_L1N_M0_CMPMISO_2)
M1: R10.2 U1.N12(IO_L13P_M1_2)
MISO_ARD: U1.A15(IO_L64N_SCP4_0) ; port SPI_ARD.MISO_ARD
MISO_FPGA: U1.R13(IO_L3P_D0_DIN_MISO_MISO1_2) ; port SPI_CONFIG_FPGA.MISO_FPGA
MOSI_ARD: U1.B16(IO_L65P_SCP3_0) ; port SPI_ARD.MOSI_ARD
MOSI_FPGA: U1.T13(IO_L3N_MOSI_CSI_B_MISO0_2) ; port SPI_CONFIG_FPGA.MOSI_FPGA
MUX_SEL: U1.U1(IO_L32N_M3DQ15_3) ; port FPGA_PROG.MUX_SEL
PCIE_CLK_N: U1.A8(MGTREFCLK0N_101) ; port PCIE_FPGA.PCIE_CLK_N
PCIE_CLK_P: U1.B8(MGTREFCLK0P_101) ; port PCIE_FPGA.PCIE_CLK_P
PCIE_PERST: U1.A3(IO_L2N_0) ; port PCIE_FPGA.PERST#
PCIE_RX0_N: U1.C5(MGTRXN0_101) ; port PCIE_FPGA.PCIE_RX0_N
PCIE_RX0_P: U1.D5(MGTRXP0_101) ; port PCIE_FPGA.PCIE_RX0_P
PCIE_SMB_CLK: U1.E8(IO_L35N_GCLK16_0) ; port PCIE_FPGA.PCIE_SMB_CLK
PCIE_SMB_DATA: U1.G9(IO_L36P_GCLK15_0) ; port PCIE_FPGA.PCIE_SMB_DATA
PCIE_TX0_N: U1.A4(MGTTXN0_101) ; port PCIE_FPGA.PCIE_TX0_N
PCIE_TX0_P: U1.B4(MGTTXP0_101) ; port PCIE_FPGA.PCIE_TX0_P
PCIE_USB_DN: U1.F7(IO_L34N_GCLK18_0) ; port PCIE_FPGA.PCIE_USB_D-
PCIE_USB_DP: U1.E6(IO_L34P_GCLK19_0) ; port PCIE_FPGA.PCIE_USB_D+
PCIE_W_DISABLE: U1.A2(IO_L1N_VREF_0) ; port PCIE_FPGA.WIFI_DISABLE#
PCIE_WAKE: U1.B3(IO_L2P_0) ; port PCIE_FPGA.WAKE#
PROGRAM_B: R8.1 U1.V2(PROGRAM_B_2) ; port FPGA_PROG.PROGRAM_B
RxD_SPI_MOSI: U1.V5(IO_L49N_D4_2) ; port GPS_FPGA.RxD_SPI_MOSI
SCL_SPI_CLK: U1.U5(IO_L49P_D3_2) ; port GPS_FPGA.SCL_SPI_CLK
SCLK_ARD: U1.A16(IO_L65N_SCP2_0) ; port SPI_ARD.SCLK_ARD
SDA_SPI_CS_N: U1.V6(IO_L45N_2) ; port GPS_FPGA.SDA_SPI_CS_N
SRAM0_CS_N: U1.F16(IO_L1N_A24_VREF_1) ; port SRAM.SRAM0_CS_N
SRAM0_HBE_N: U1.L15(IO_L42P_GCLK7_M1UDM_1) ; port SRAM.SRAM0_HBE_N
SRAM0_LBE_N: U1.L16(IO_L42N_GCLK6_TRDY1_M1LDM_1) ; port SRAM.SRAM0_LBE_N
SRAM0_OE_N: U1.K16(IO_L41N_GCLK8_M1CASN_1) ; port SRAM.SRAM0_OE_N
SRAM0_WE_N: U1.P17(IO_L49P_M1DQ10_1) ; port SRAM.SRAM0_WE_N
SRAM_A0: U1.J16(IO_L44P_A3_M1DQ6_1)
SRAM_A1: U1.H15(IO_L37P_A7_M1A0_1)
SRAM_A2: U1.F17(IO_L35P_A11_M1A7_1)
SRAM_A3: U1.H16(IO_L37N_A6_M1A1_1)
SRAM_A4: U1.F18(IO_L35N_A10_M1A2_1)
SRAM_A5: U1.K15(IO_L41P_GCLK9_IRDY1_M1RASN_1)
SRAM_A6: U1.G16(IO_L38P_A5_M1CLK_1)
SRAM_A7: U1.C17(IO_L29P_A23_M1A13_1)
SRAM_A8: U1.J18(IO_L44N_A2_M1DQ7_1)
SRAM_A9: U1.K18(IO_L45N_A0_M1LDQSN_1)
SRAM_A10: U1.L18(IO_L46N_FOE_B_M1DQ3_1)
SRAM_A11: U1.N18(IO_L48N_M1DQ9_1)
SRAM_A12: U1.L17(IO_L46P_FCS_B_M1DQ2_1)
SRAM_A13: U1.M18(IO_L47N_LDC_M1DQ1_1)
SRAM_A14: U1.K17(IO_L45P_A1_M1LDQS_1)
SRAM_A15: U1.N17(IO_L48P_HDC_M1DQ8_1)
SRAM_A16: U1.U18(IO_L52N_M1DQ15_1)
SRAM_A17: U1.P16(IO_L74N_DOUT_BUSY_1)
SRAM_D0: U1.E16(IO_L33P_A15_M1A10_1)
SRAM_D1: U1.D18(IO_L31N_A18_M1A12_1)
SRAM_D2: U1.D17(IO_L31P_A19_M1CKE_1)
SRAM_D3: U1.C18(IO_L29N_A22_M1A14_1)
SRAM_D4: U1.U17(IO_L52P_M1DQ14_1)
SRAM_D5: U1.T17(IO_L51P_M1DQ12_1)
SRAM_D6: U1.T18(IO_L51N_M1DQ13_1)
SRAM_D7: U1.P18(IO_L49N_M1DQ11_1)
SRAM_D8: U1.M16(IO_L47P_FWE_B_M1DQ0_1)
SRAM_D9: U1.N16(IO_L50N_M1UDQSN_1)
SRAM_D10: U1.N15(IO_L50P_M1UDQS_1)
SRAM_D11: U1.P15(IO_L74P_AWAKE_1)
SRAM_D12: U1.E18(IO_L33N_A14_M1A4_1)
SRAM_D13: U1.H17(IO_L43P_GCLK5_M1DQ4_1)
SRAM_D14: U1.G18(IO_L38N_A4_M1CLKN_1)
SRAM_D15: U1.H18(IO_L43N_GCLK4_M1DQ5_1)
TIMPULSE1: U1.U7(IO_L43P_2) ; port GPS_FPGA.TIMEPULSE1
TIMPULSE2: U1.V8(IO_L41N_VREF_2) ; port GPS_FPGA.TIMEPULSE2
TxD_SPI_MISO: U1.V7(IO_L43N_2) ; port GPS_FPGA.TxD_SPI_MISO
NetR15_2: R15.2 U1.E7(MGTRREF_101)

Not connected (* = marked no-connect by the designer): U1 A6(MGTTXN1_101) A12(MGTTXN0_123) A14(MGTTXN1_123) B2(IO_L1P_HSWAPEN_0) B6(MGTTXP1_101) B12(MGTTXP0_123) B14(MGTTXP1_123) D3(IO_L54N_M3A11_3) E3(IO_L50P_M3WE_3) E4(IO_L54P_M3RESET_3) F3(IO_L51N_M3A4_3) F4(IO_L51P_M3A10_3) F5(IO_L55N_M3A14_3) F6(IO_L55P_M3A13_3) F14(IO_L30P_A21_M1RESET_1) F15(IO_L1P_A25_1) G3(IO_L46P_M3CLK_3) G6(IO_L53N_M3A12_3) G8(IO_L35P_GCLK17_0) G13(IO_L32N_A16_M1A9_1) G14(IO_L30N_A20_M1A11_1) H3(IO_L44N_GCLK20_M3A6_3) H4(IO_L44P_GCLK21_M3A5_3) H5(IO_L49N_M3A2_3) H6(IO_L49P_M3A7_3) H7(IO_L53P_M3CKE_3) H12(IO_L32P_A17_M1A8_1) H13(IO_L36P_A9_M1BA0_1) H14(IO_L36N_A8_M1BA1_1) J3(IO_L40P_M3DQ6_3) J6(IO_L47N_M3A1_3) J7(IO_L47P_M3A0_3) J13(IO_L39P_M1A3_1) K2(IO_L38P_M3DQ2_3) K3(IO_L42N_GCLK24_M3LDM_3) K4(IO_L42P_GCLK25_TRDY2_M3UDM_3) K5(IO_L43N_GCLK22_IRDY2_M3CASN_3) K6(IO_L45N_M3ODT_3) K12(IO_L34P_A13_M1WE_1) K13(IO_L34N_A12_M1BA2_1) K14(IO_L39N_M1ODT_1) L1(IO_L37N_M3DQ1_3) L2(IO_L37P_M3DQ0_3) L3(IO_L39N_M3LDQSN_3) L4(IO_L39P_M3LDQS_3) L5(IO_L43P_GCLK23_M3RASN_3) L6(IO_L31P_3) L7(IO_L45P_M3A3_3) L12(IO_L40P_GCLK11_M1A5_1) L13(IO_L40N_GCLK10_M1A6_1) L14(IO_L61P_1) M1(IO_L36N_M3DQ9_3) M3(IO_L36P_M3DQ8_3) M5(IO_L31N_VREF_3) M8(IO_L40P_2) M10(IO_L22P_2) M11(IO_L15P_2) M13(IO_L61N_1) M14(IO_L53P_1) N1(IO_L35N_M3DQ11_3) N2(IO_L35P_M3DQ10_3) N3(IO_L1N_VREF_3) N4(IO_L1P_3) N5(IO_L64P_D8_2) N6(IO_L47P_2) N7(IO_L44P_2) N8(IO_L40N_2) N9(IO_L22N_2) N10(IO_L20P_2) N11(IO_L15N_2) N14(IO_L53N_VREF_1) P1(IO_L34N_M3UDQSN_3) P2(IO_L34P_M3UDQS_3) P3(IO_L2N_3) P4(IO_L2P_3) P6(IO_L64N_D9_2) P7(IO_L47N_2) P8(IO_L44N_2) P11(IO_L20N_2) P12(IO_L13N_D10_2) P13(CMPCS_B_2)* R3(IO_L62P_D5_2) R5(IO_L48P_D7_2) R7(IO_L46P_2) R8(IO_L31P_GCLK31_D14_2) R11(IO_L16P_2) T1(IO_L33N_M3DQ13_3) T2(IO_L33P_M3DQ12_3) T3(IO_L62N_D6_2) T4(IO_L63P_2) T5(IO_L48N_RDWR_B_VREF_2) T6(IO_L45P_2) T7(IO_L46N_2) T8(IO_L31N_GCLK30_D15_2) T9(IO_L32P_GCLK29_2) T10(IO_L29N_GCLK2_2) T11(IO_L16N_VREF_2) T12(IO_L19P_2) T14(IO_L12P_D1_MISO2_2) U2(IO_L32P_M3DQ14_3) U13(IO_L14P_D11_2) U15(IO_L5P_2) U16(IO_L2P_CMPCLK_2) V11(IO_L23N_2) V15(IO_L5N_2)

### Buses and harness runs
bus SRAM_A[0..17]
bus SRAM_D[0..15]

### Notes on the sheet
- USB需要和差分IO连接。即IO_LXXP和IO_LXXN
- (near R14) 4 x 33R
- UG386-P165: The trace lengths from the resistor pins to the FPGA pins MGTRREF and MGTVTTRCAL must be equal in length
- FPGA_CLK 需要和GCLK的pin连接
- IO_HDR1还没有与FPGA连接。
- (in symbol XC6SLX45T-2CSG324C, part A) BANK 0
- (in symbol XC6SLX45T-2CSG324C, part B) BANK 1
- (in symbol XC6SLX45T-2CSG324C, part C) BANK 2
- (in symbol XC6SLX45T-2CSG324C, part D) BANK 3

### Library data of the parts
C1-C6 = C0402: Ceramic Chip Capacitor - Standard; Note: Footprint corresponds to dimensions for bulk cassette packaging. This case size has tightened tolerances.; Published: 17-Jul-2002; LatestRevisionDate: 19-Mar-2004; LatestRevisionNote: Silkscreen size reduced.; DatasheetDocument: Mar-2001; PackageDocument: Mar-2001; PackageReference: 0402; Publisher: Altium Limited; Code_JEITA: 0402; Code_IPC: 1005 [0402]; ComponentLink1Description: Manufacturer Link; ComponentLink1URL: http://www.kemet.com/; ComponentLink2Description: Datasheet; ComponentLink2URL: http://www.kemet.com/kemet/web/homepage/kechome.nsf/vapubfilesname/F3102TA.pdf/$file/F3102TA.pdf
C7 = C0603: Ceramic Chip Capacitor - Standard; Note: Footprint corresponds to dimensions for bulk cassette packaging. This case size has tightened tolerances.; Published: 17-Jul-2002; LatestRevisionDate: 19-Mar-2004; LatestRevisionNote: Silkscreen size reduced.; DatasheetDocument: Mar-2001; PackageDocument: Mar-2001; PackageReference: 0603; Publisher: Altium Limited; Code_JEITA: 0603; Code_IPC: 1608 [0603]; ComponentLink1Description: Manufacturer Link; ComponentLink1URL: http://www.kemet.com/; ComponentLink2Description: Datasheet; ComponentLink2URL: http://www.kemet.com/kemet/web/homepage/kechome.nsf/vapubfilesname/F3102TA.pdf/$file/F3102TA.pdf
R1 R3 = 0402 (1005 Metric) 1/16 W 100R 1 Thick Film Chip Resistor: Manufacturer_PN: CR0603-FX-1000ELFDKR-ND; Power: 1/16 W; Case-Metric: 1005; Case-EIA: 0402; Temp Coefficient ppm/°C: ±100; Tolerance %: 1%; Value (Ohms): 100; Technology: SMT; Manufacturer Part Number: CR0603-FX-1000ELFDKR-ND
R2 R4-R8 R16 R17 = 0402 (1005 Metric) 1/16 W 4K7 1 Thick Film Chip Resistor: as R18 on sheet Arduino FPGA Design; Technology: SMT; Manufacturer Part Number: CR0402-FX-4701GLFDKR-ND
R9 = 0402 (1005 Metric) 1/16 W 330R 1 Thick Film Chip Resistor: Manufacturer_PN: RC1005F331CS; Case-EIA: 0402; Case-Metric: 1005; Power: 1/16 W; Temp Coefficient ppm/°C: ±100; Tolerance %: 1%; Value (Ohms): 330; Technology: SMT; Manufacturer Part Number: RC1005F331CS
R10 = 0402 (1005 Metric) 1/16 W 1K 1 Thick Film Chip Resistor: Manufacturer_PN: CR0402-FX-1001GLFDKR-ND; Power: 1/16 W; Case-Metric: 1005; Case-EIA: 0402; Temp Coefficient ppm/°C: ±100; Tolerance %: 1%; Value (Ohms): 1000; Technology: SMT; Manufacturer Part Number: CR0402-FX-1001GLFDKR-ND
R11-R14 = 0402 (1005 Metric) 1/16 W 33R 1 Thick Film Chip Resistor: Manufacturer_PN: RC1005F330CS; Power: 1/16 W; Case-EIA: 0402; Case-Metric: 1005; Temp Coefficient ppm/°C: ±100; Tolerance %: 1%; Value (Ohms): 33; Technology: SMT; Value: 33R; Manufacturer Part Number: RC1005F330CS
R15 = Res1: Resistor; Published: 8-Jun-2000; LatestRevisionDate: 17-Jul-2002; LatestRevisionNote: Re-released for DXP Platform.; PackageReference: AXIAL-0.3; Publisher: Altium Limited; PackageDescription: Axial Device, Thru-Hole; 2 Leads; 0.3 in Pin Spacing
U1 = XC6SLX45T-2CSG324C: Spartan-6 LXT 1.2V FPGA, 190 User I/Os, 324-Ball Chip-Scale BGA (0.8mm Pitch), Speed Grade 2, Commercial Grade, Pb-Free; Published: 17-Nov-2009; DatasheetVersion: ver1.6, Nov-2010; PackageVersion: ver1.1, Nov-2009; PackageReference: CSG324; Publisher: Altium Limited; PackageDescription: 324-Ball Chip-Scale BGA (CSG324) Package, 0.8 mm Pitch; Supplier 1: Digi-Key; Supplier Part Number 1: XC6SLX45T-2CSG324C-ND; Code_JEDEC: MO-275-KKAC-1; ComponentLink1Description: Manufacturer Link; ComponentLink1URL: http://www.xilinx.com; ComponentLink2Description: Spartan-6 Datasheet; ComponentLink2URL: http://www.xilinx.com/support/documentation/data_sheets/ds160.pdf; ComponentLink3Description: Spartan-6 Documents; ComponentLink3URL: http://www.xilinx.com/support/documentation/spartan-6.htm; ComponentLink4Description: Xilinx.com Home; ComponentLink4URL: http://www.xilinx.com

## Sheet FPGA - Decoupling.SchDoc
size A4
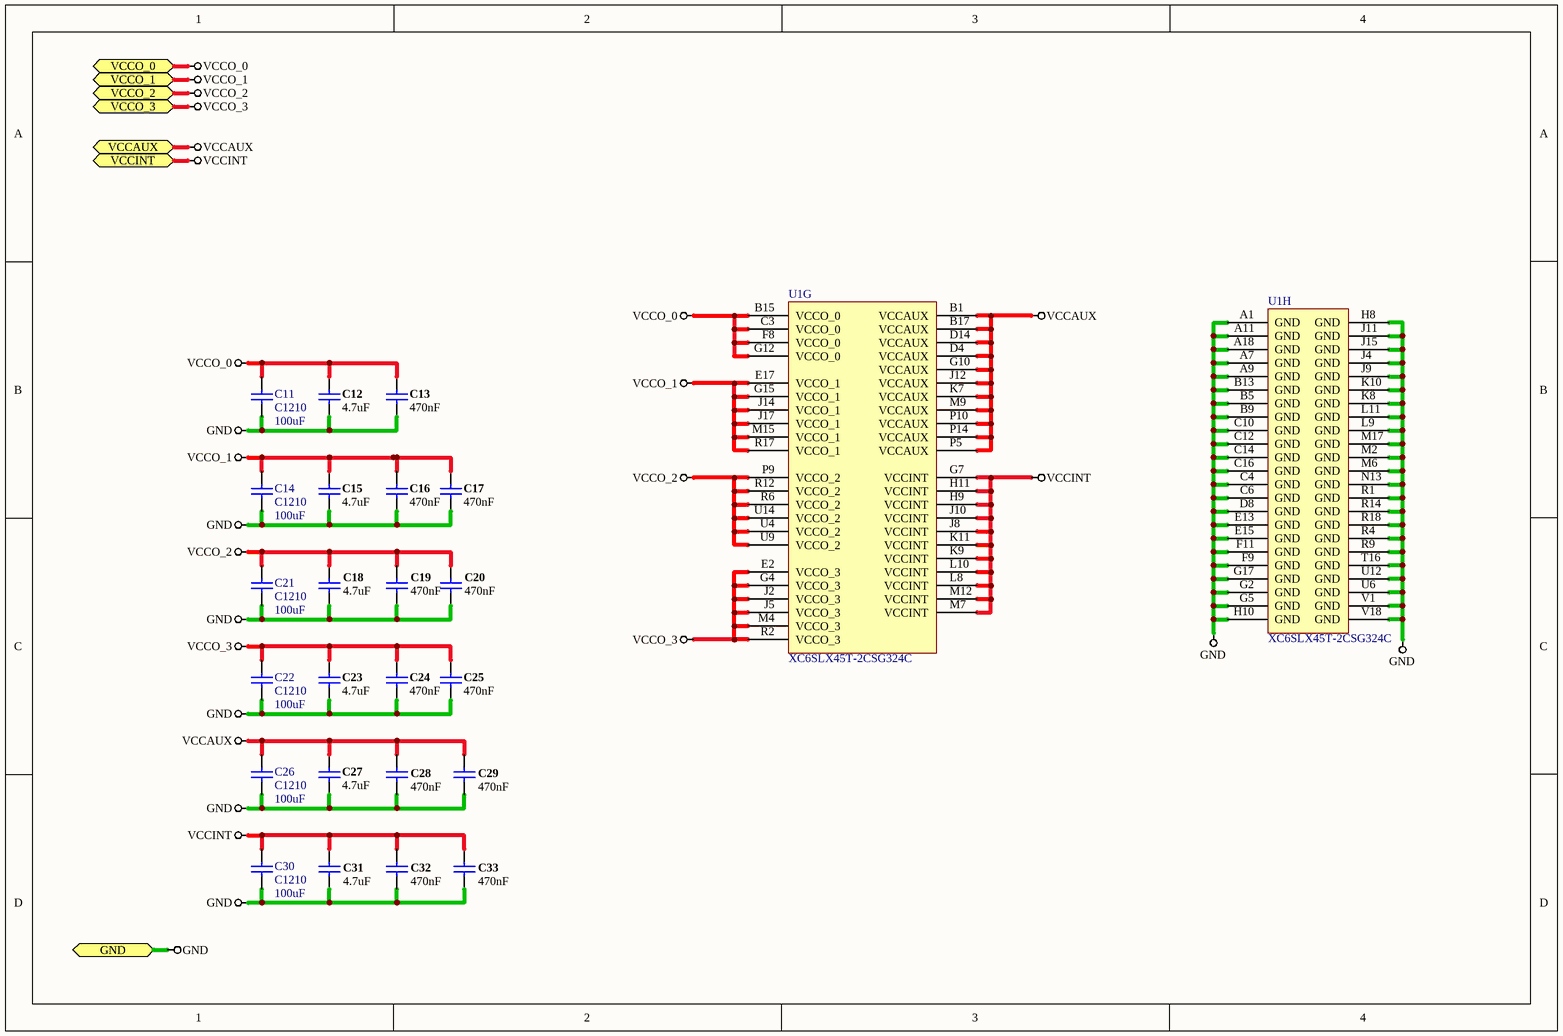
[diagram p5: FPGA - Decoupling.SchDoc]

### Parts
C11  C1210  value 100uF  [C-1210]
C12  value 4.7uF  [CAPC0603(1608)55_L]  (hidden comment: CAP 4.7uF 10V 0603(1608))
C13  value 470nF  [CAPC0402(1005)60_L]  (hidden comment: CAP 470nF 10V 0402(1005))
C14  C1210  value 100uF  [C-1210]
C15  value 4.7uF  [CAPC0603(1608)55_L]  (hidden comment: CAP 4.7uF 10V 0603(1608))
C16  value 470nF  [CAPC0402(1005)60_L]  (hidden comment: CAP 470nF 10V 0402(1005))
C17  value 470nF  [CAPC0402(1005)60_L]  (hidden comment: CAP 470nF 10V 0402(1005))
C18  value 4.7uF  [CAPC0603(1608)55_L]  (hidden comment: CAP 4.7uF 10V 0603(1608))
C19  value 470nF  [CAPC0402(1005)60_L]  (hidden comment: CAP 470nF 10V 0402(1005))
C20  value 470nF  [CAPC0402(1005)60_L]  (hidden comment: CAP 470nF 10V 0402(1005))
C21  C1210  value 100uF  [C-1210]
C22  C1210  value 100uF  [C-1210]
C23  value 4.7uF  [CAPC0603(1608)55_L]  (hidden comment: CAP 4.7uF 10V 0603(1608))
C24  value 470nF  [CAPC0402(1005)60_L]  (hidden comment: CAP 470nF 10V 0402(1005))
C25  value 470nF  [CAPC0402(1005)60_L]  (hidden comment: CAP 470nF 10V 0402(1005))
C26  C1210  value 100uF  [C-1210]
C27  value 4.7uF  [CAPC0603(1608)55_L]  (hidden comment: CAP 4.7uF 10V 0603(1608))
C28  value 470nF  [CAPC0402(1005)60_L]  (hidden comment: CAP 470nF 10V 0402(1005))
C29  value 470nF  [CAPC0402(1005)60_L]  (hidden comment: CAP 470nF 10V 0402(1005))
C30  C1210  value 100uF  [C-1210]
C31  value 4.7uF  [CAPC0603(1608)55_L]  (hidden comment: CAP 4.7uF 10V 0603(1608))
C32  value 470nF  [CAPC0402(1005)60_L]  (hidden comment: CAP 470nF 10V 0402(1005))
C33  value 470nF  [CAPC0402(1005)60_L]  (hidden comment: CAP 470nF 10V 0402(1005))
U1  XC6SLX45T-2CSG324C  [CSG324]  (parts G,H of 8)

### Ports
GND, VCCAUX, VCCINT, VCCO_0, VCCO_1, VCCO_2, VCCO_3

### Nets
GND: C11.1 C12.1 C13.1 C14.1 C15.1 C16.1 C17.1 C18.1 C19.1 C20.1 C21.1 C22.1 C23.1 C24.1 C25.1 C26.1 C27.2 C28.2 C29.2 C30.1 C31.2 C32.2 C33.2 U1.A1(GND) U1.A7(GND) U1.A9(GND) U1.A11(GND) U1.A18(GND) U1.B5(GND) U1.B9(GND) U1.B13(GND) U1.C4(GND) U1.C6(GND) U1.C10(GND) U1.C12(GND) U1.C14(GND) U1.C16(GND) U1.D8(GND) U1.E13(GND) U1.E15(GND) U1.F9(GND) U1.F11(GND) U1.G2(GND) U1.G5(GND) U1.G17(GND) U1.H8(GND) U1.H10(GND) U1.J4(GND) U1.J9(GND) U1.J11(GND) U1.J15(GND) U1.K8(GND) U1.K10(GND) U1.L9(GND) U1.L11(GND) U1.M2(GND) U1.M6(GND) U1.M17(GND) U1.N13(GND) U1.R1(GND) U1.R4(GND) U1.R9(GND) U1.R14(GND) U1.R18(GND) U1.T16(GND) U1.U6(GND) U1.U12(GND) U1.V1(GND) U1.V18(GND) ; port GND  [project net AGND]
VCCAUX: C26.2 C27.1 C28.1 C29.1 U1.B1(VCCAUX) U1.B17(VCCAUX) U1.D4(VCCAUX) U1.D14(VCCAUX) U1.G10(VCCAUX) U1.J12(VCCAUX) U1.K7(VCCAUX) U1.M9(VCCAUX) U1.P5(VCCAUX) U1.P10(VCCAUX) U1.P14(VCCAUX) ; port VCCAUX
VCCINT: C30.2 C31.1 C32.1 C33.1 U1.G7(VCCINT) U1.H9(VCCINT) U1.H11(VCCINT) U1.J8(VCCINT) U1.J10(VCCINT) U1.K9(VCCINT) U1.K11(VCCINT) U1.L8(VCCINT) U1.L10(VCCINT) U1.M7(VCCINT) U1.M12(VCCINT) ; port VCCINT
VCCO_0: C11.2 C12.2 C13.2 U1.B15(VCCO_0) U1.C3(VCCO_0) U1.F8(VCCO_0) U1.G12(VCCO_0) ; port VCCO_0
VCCO_1: C14.2 C15.2 C16.2 C17.2 U1.E17(VCCO_1) U1.G15(VCCO_1) U1.J14(VCCO_1) U1.J17(VCCO_1) U1.M15(VCCO_1) U1.R17(VCCO_1) ; port VCCO_1
VCCO_2: C18.2 C19.2 C20.2 C21.2 U1.P9(VCCO_2) U1.R6(VCCO_2) U1.R12(VCCO_2) U1.U4(VCCO_2) U1.U9(VCCO_2) U1.U14(VCCO_2) ; port VCCO_2
VCCO_3: C22.2 C23.2 C24.2 C25.2 U1.E2(VCCO_3) U1.G4(VCCO_3) U1.J2(VCCO_3) U1.J5(VCCO_3) U1.M4(VCCO_3) U1.R2(VCCO_3) ; port VCCO_3

### Library data of the parts
C11 C14 C21 C22 C26 C30 = C1210: GRM32ER60J107ME20L; Manufacturer Name: Murata; Manufacturer Part Number: GRM32ER60J107ME20L
C12 C15 C18 C23 C27 C31 = CAP 4.7uF 10V ±10% 0603 (1608 Metric) Thickness 0.55mm SMD: Manufacturer_PN: CC0603KRX5R6BB475; Case-Metric: 1608; Case-EIA: 0603; Tolerance: ±10%; Rated Voltage: 10 V; Technology: SMT; Max Thickness: 0.55 mm; Manufacturer Part Number: CC0603KRX5R6BB475
C13 C16 C17 C19 C20 C24 C25 C28 C29 C32 C33 = CAP 470nF 10V ±10% 0402 (1005 Metric) Thickness 0.6mm SMD: Manufacturer_PN: LMK105BJ474KV-F; Case-Metric: 1005; Case-EIA: 0402; Tolerance: ±10%; Rated Voltage: 10 V; Max Thickness: 0.6 mm; Technology: SMT; Manufacturer Part Number: LMK105BJ474KV-F
U1 = XC6SLX45T-2CSG324C: as U1 on sheet FPGA - XC6SLX45T-2CSG324C; Published: 17-Nov-2009; DatasheetVersion: ver1.6, Nov-2010; PackageVersion: ver1.1, Nov-2009; PackageReference: CSG324; Publisher: Altium Limited; PackageDescription: 324-Ball Chip-Scale BGA (CSG324) Package, 0.8 mm Pitch; Supplier 1: Digi-Key; Supplier Part Number 1: XC6SLX45T-2CSG324C-ND; Code_JEDEC: MO-275-KKAC-1; ComponentLink1Description: Manufacturer Link; ComponentLink1URL: http://www.xilinx.com; ComponentLink2Description: Spartan-6 Datasheet; ComponentLink2URL: http://www.xilinx.com/support/documentation/data_sheets/ds160.pdf; ComponentLink3Description: Spartan-6 Documents; ComponentLink3URL: http://www.xilinx.com/support/documentation/spartan-6.htm; ComponentLink4Description: Xilinx.com Home; ComponentLink4URL: http://www.xilinx.com

## Sheet Arduino FPGA SPI MUX.SchDoc
size A4
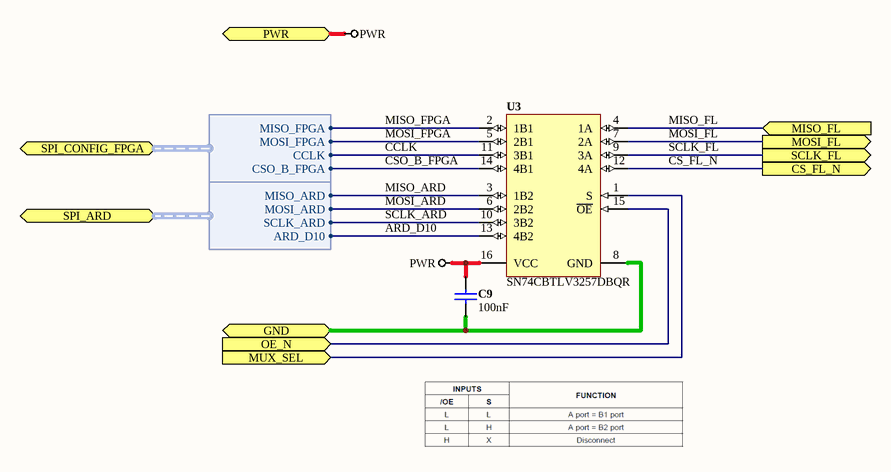
[diagram p6: Arduino FPGA SPI MUX.SchDoc]

### Parts
C9  value 100nF  [CAPC0402(1005)60_L]  (hidden comment: CAP 100nF 16V 0402(1005))
U3  SN74CBTLV3257DBQR  [DBQ16]

### Ports
CS_FL_N (out), GND, MISO_FL (in), MOSI_FL (out), MUX_SEL (in), OE_N (in), PWR, SCLK_FL (out), SPI_ARD (harness SPI_ARD), SPI_CONFIG_FPGA (harness SPI_CONFIG_FPGA)

### Harnesses
SPI_CONFIG_FPGA: CSO_B_FPGA, CCLK, MISO_FPGA, MOSI_FPGA
SPI_ARD: MISO_ARD, MOSI_ARD, SCLK_ARD, ARD_D10

### Nets
AGND: C9.2 U3.8(GND) ; port GND
PWR: C9.1 U3.16(VCC) ; port PWR
ARD_D10: U3.13(4B2) ; port SPI_ARD.ARD_D10
CCLK: U3.11(3B1) ; port SPI_CONFIG_FPGA.CCLK
CS_FL_N: U3.12(4A) ; port CS_FL_N
CSO_B_FPGA: U3.14(4B1) ; port SPI_CONFIG_FPGA.CSO_B_FPGA
MISO_ARD: U3.3(1B2) ; port SPI_ARD.MISO_ARD
MISO_FL: U3.4(1A) ; port MISO_FL
MISO_FPGA: U3.2(1B1) ; port SPI_CONFIG_FPGA.MISO_FPGA
MOSI_ARD: U3.6(2B2) ; port SPI_ARD.MOSI_ARD
MOSI_FL: U3.7(2A) ; port MOSI_FL
MOSI_FPGA: U3.5(2B1) ; port SPI_CONFIG_FPGA.MOSI_FPGA
SCLK_ARD: U3.10(3B2) ; port SPI_ARD.SCLK_ARD
SCLK_FL: U3.9(3A) ; port SCLK_FL
NetU3_1: U3.1(S) ; port MUX_SEL
NetU3_15: U3.15(~{OE}) ; port OE_N

### Library data of the parts
C9 = CAP 100nF 16V ±10% 0402 (1005 Metric) Thickness 0.6mm SMD: as C8 on sheet Arduino FPGA Design; Max Thickness: 0.6 mm; Rated Voltage: 16 V; Technology: SMT; Manufacturer Part Number: C0402C104K8PACTU
U3 = SN74CBTLV3257DBQR: Low-Voltage 4-Bit 1-Of-2 FET Multiplexer/Demultiplexer, 16-pin SOP (DBQ16); Supply Voltage: 2.3 to 3.6 V; Channel: 4; DatasheetVersion: SCDS040J, 10/2003; Mounting Technology: Surface Mount; PartNumber: SN74CBTLV3257DBQR; ComponentLink3URL: http://www.ti.com/lit/ml/msoi004g/msoi004g.pdf; ComponentLink2Description: Datasheet; ComponentLink1URL: http://www.ti.com/; PackageVersion: 4073301-2/H, 10/2008; ComponentLink1Description: Manufacturer URL; ComponentLink3Description: Package Specification; PackageDescription: 16-Pin Plastic Small Outline, 3.9 x 4.9 mm Body, 0.635 mm Pitch; ComponentLink2URL: http://www.ti.com/lit/ds/symlink/sn74cbtlv3257.pdf; PackageReference: DBQ16; Manufacturer_PN: SN74CBTLV3257DBQR; Manufacturer Part Number: SN74CBTLV3257DBQR

## Sheet SRAM0 - IS61WV12816DBLL-10BLI.SchDoc
size A4
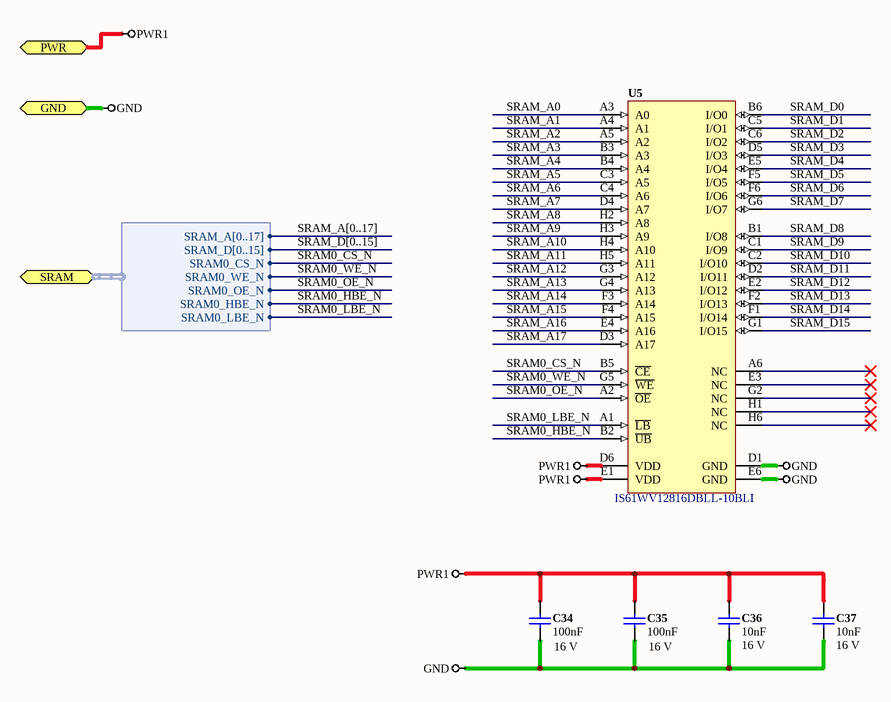
[diagram p7: SRAM0 - IS61WV12816DBLL-10BLI.SchDoc]

### Parts
C34  value 100nF  Rated Voltage: 16 V  [CAPC0402(1005)60_L]  (hidden comment: CAP 100nF 16V 0402(1005))
C35  value 100nF  Rated Voltage: 16 V  [CAPC0402(1005)60_L]  (hidden comment: CAP 100nF 16V 0402(1005))
C36  value 10nF  Rated Voltage: 16 V  [CAPC0402(1005)33_L]  (hidden comment: CAP 10nF 16V 0402(1005))
C37  value 10nF  Rated Voltage: 16 V  [CAPC0402(1005)33_L]  (hidden comment: CAP 10nF 16V 0402(1005))
U5  IS61WV12816DBLL-10BLI  [ISSI-TF-BGA-48-6000X8000DE]

### Ports
GND, PWR, SRAM (harness SRAM)

### Harnesses
SRAM: SRAM_A[0..17], SRAM_D[0..15], SRAM0_CS_N, SRAM0_WE_N, SRAM0_OE_N, SRAM0_HBE_N, SRAM0_LBE_N

### Nets
GND: C34.2 C35.2 C36.2 C37.2 U5.D1(GND) U5.E6(GND) ; port GND  [project net AGND]
PWR1: C34.1 C35.1 C36.1 C37.1 U5.D6(VDD) U5.E1(VDD) ; port PWR  [project net PWR]
SRAM0_CS_N: U5.B5(~{CE}) ; port SRAM.SRAM0_CS_N
SRAM0_HBE_N: U5.B2(~{UB}) ; port SRAM.SRAM0_HBE_N
SRAM0_LBE_N: U5.A1(~{LB}) ; port SRAM.SRAM0_LBE_N
SRAM0_OE_N: U5.A2(~{OE}) ; port SRAM.SRAM0_OE_N
SRAM0_WE_N: U5.G5(~{WE}) ; port SRAM.SRAM0_WE_N
SRAM_A0: U5.A3(A0)
SRAM_A1: U5.A4(A1)
SRAM_A2: U5.A5(A2)
SRAM_A3: U5.B3(A3)
SRAM_A4: U5.B4(A4)
SRAM_A5: U5.C3(A5)
SRAM_A6: U5.C4(A6)
SRAM_A7: U5.D4(A7)
SRAM_A8: U5.H2(A8)
SRAM_A9: U5.H3(A9)
SRAM_A10: U5.H4(A10)
SRAM_A11: U5.H5(A11)
SRAM_A12: U5.G3(A12)
SRAM_A13: U5.G4(A13)
SRAM_A14: U5.F3(A14)
SRAM_A15: U5.F4(A15)
SRAM_A16: U5.E4(A16)
SRAM_A17: U5.D3(A17)
SRAM_D0: U5.B6(I/O0)
SRAM_D1: U5.C5(I/O1)
SRAM_D2: U5.C6(I/O2)
SRAM_D3: U5.D5(I/O3)
SRAM_D4: U5.E5(I/O4)
SRAM_D5: U5.F5(I/O5)
SRAM_D6: U5.F6(I/O6)
SRAM_D7: U5.G6(I/O7)
SRAM_D8: U5.B1(I/O8)
SRAM_D9: U5.C1(I/O9)
SRAM_D10: U5.C2(I/O10)
SRAM_D11: U5.D2(I/O11)
SRAM_D12: U5.E2(I/O12)
SRAM_D13: U5.F2(I/O13)
SRAM_D14: U5.F1(I/O14)
SRAM_D15: U5.G1(I/O15)

Not connected (* = marked no-connect by the designer): U5 A6(NC)* E3(NC)* G2(NC)* H1(NC)* H6(NC)*

### Buses and harness runs
bus SRAM_A[0..17]
bus SRAM_D[0..15]

### Library data of the parts
C34 C35 = CAP 100nF 16V ±10% 0402 (1005 Metric) Thickness 0.6mm SMD: as C8 on sheet Arduino FPGA Design; Max Thickness: 0.6 mm; Technology: SMT; Manufacturer Part Number: C0402C104K8PACTU
C36 C37 = CMP-1034-01875-1: CAP 10nF 16V ±10% 0402 (1005 Metric) Thickness 0.33mm SMD; Manufacturer_PN: GRM155R61C103KA01D; Case-EIA: 0402; Case-Metric: 1005; Max Thickness: 0.33 mm; Tolerance: ±10%; Technology: SMT; Manufacturer Part Number: GRM155R61C103KA01D
U5 = CMP-0513-00111-1: 2 M High Speed Asynchronous CMOS SRAM, 128 K x 16, -40 to 85 degC, 48-Pin BGA (TF-BGA-48), Pb-Free; Manufacturer: Integrated Silicon Solution Inc (ISSI); Speed (ns): 10; Packing: Tray / Tube; Mounting Technology: Surface Mount; DatasheetVersion: Rev. D; PackageReference: TF-BGA-48; ComponentLink2URL: http://www.issi.com/WW/pdf/61-64WV12816DAxx-DBxx.pdf; PartNumber: IS61WV12816DBLL-10BLI; ComponentLink2Description: Datasheet; PackageDescription: 48-Pin 6 x 8 mm TF-BGA, Pitch 0.75 mm; ComponentLink1Description: Manufacturer URL; Code_JEDEC: MO-207; PackageVersion: Rev. C, 08/2008; Organization: 128K x 16; RoHS: Pb-Free; ComponentLink1URL: http://www.issi.com/US/index.shtml; ComponentLink3URL: http://www.issi.com/WW/pdf/61-64WV25616.pdf; ComponentLink3Description: Package Specification; Manufacturer_PN: IS61WV12816DBLL-10BLI; Manufacturer Part Number: IS61WV12816DBLL-10BLI

## Sheet PCIE - mini-pcie-connector.SchDoc
size A4
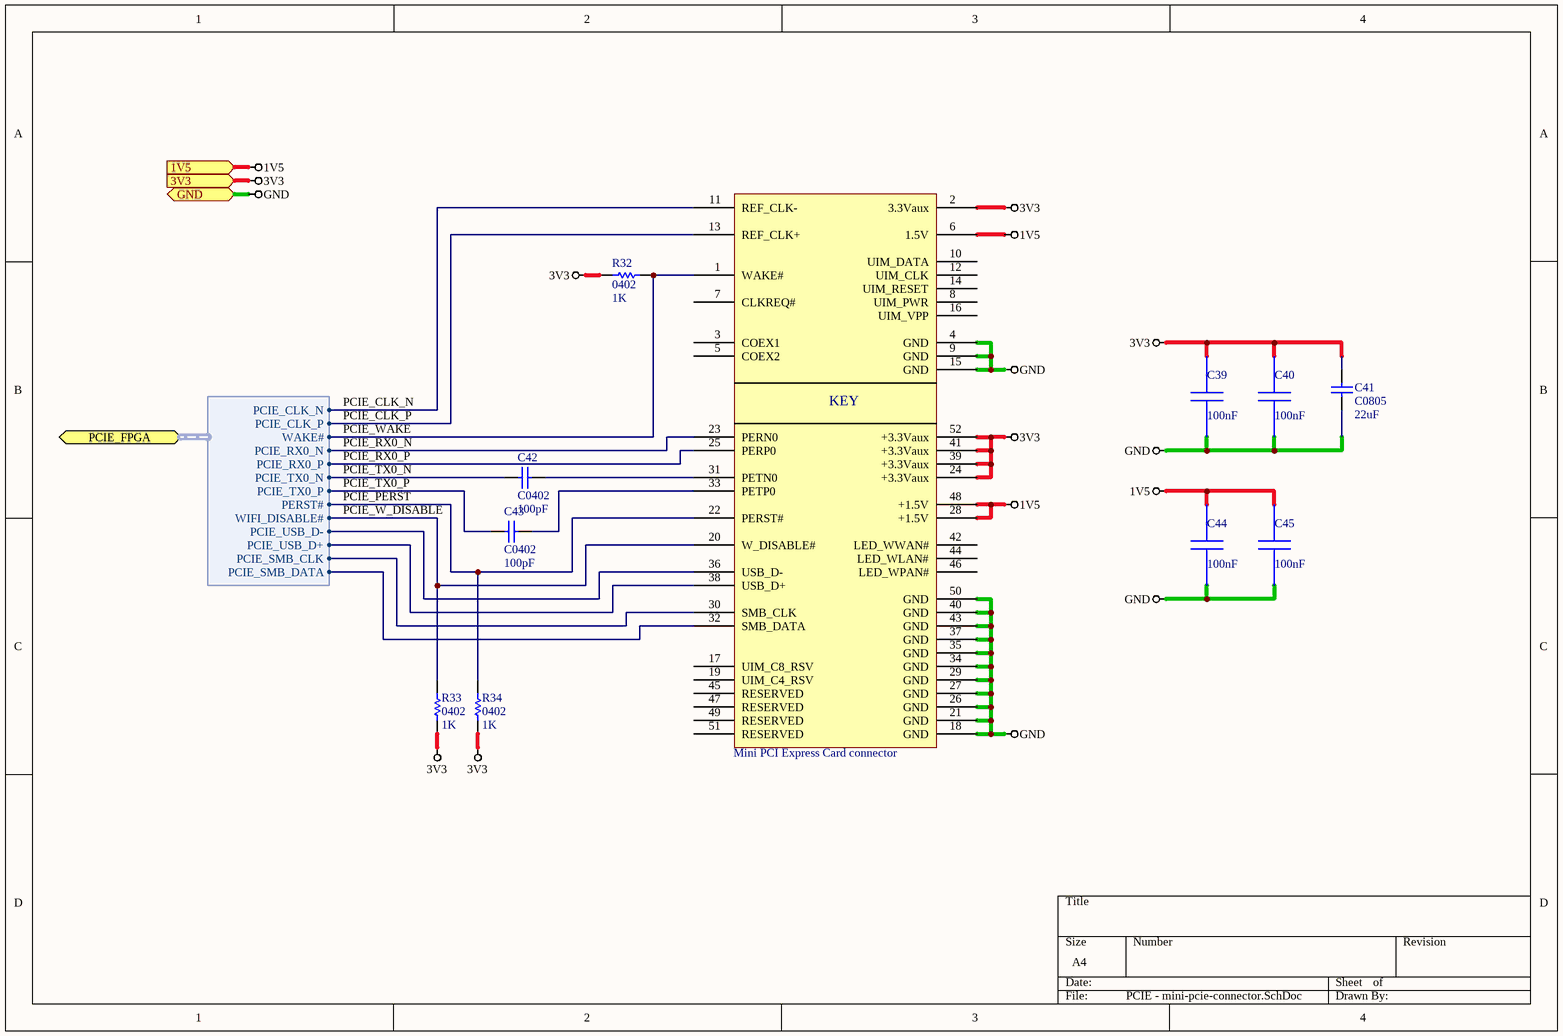
[diagram p8: PCIE - mini-pcie-connector.SchDoc]

### Parts
C39  value 100nF  [C-0603]  (hidden comment: C0603C104K3RACTU)
C40  value 100nF  [C-0603]  (hidden comment: C0603C104K3RACTU)
C41  C0805  value 22uF  [C-0805]
C42  C0402  value 100pF  [CAPC0402(1005)60_L]
C43  C0402  value 100pF  [CAPC0402(1005)60_L]
C44  value 100nF  [C-0603]  (hidden comment: C0603C104K3RACTU)
C45  value 100nF  [C-0603]  (hidden comment: C0603C104K3RACTU)
CN1  Mini PCI Express Card connector  [Mini PCI Express]  (no BOM)
R32  0402  value 1K  [RESC0402(1005)40_L]
R33  0402  value 1K  [RESC0402(1005)40_L]
R34  0402  value 1K  [RESC0402(1005)40_L]

### Ports
1V5 (in), 3V3 (in), GND, PCIE_FPGA (harness PCIE_FPGA)

### Harnesses
PCIE_FPGA: PCIE_CLK_N, PCIE_CLK_P, PCIE_RX0_N, PCIE_RX0_P, PCIE_TX0_N, PCIE_TX0_P, PERST#, WIFI_DISABLE#, PCIE_USB_D-, PCIE_USB_D+, PCIE_SMB_CLK, PCIE_SMB_DATA, WAKE#

### Nets
1V5: C44.1 C45.1 CN1.6(1.5V) CN1.28(+1.5V) CN1.48(+1.5V) ; port 1V5
3V3: C39.1 C40.1 C41.2 CN1.2(3.3Vaux) CN1.24(+3.3Vaux) CN1.39(+3.3Vaux) CN1.41(+3.3Vaux) CN1.52(+3.3Vaux) R32.1 R33.1 R34.1 ; port 3V3
GND: C39.2 C40.2 C41.1 C44.2 C45.2 CN1.4(GND) CN1.9(GND) CN1.15(GND) CN1.18(GND) CN1.21(GND) CN1.26(GND) CN1.27(GND) CN1.29(GND) CN1.34(GND) CN1.35(GND) CN1.37(GND) CN1.40(GND) CN1.43(GND) CN1.50(GND) ; port GND  [project net AGND]
PCIE_CLK_N: CN1.11(REF_CLK-) ; port PCIE_FPGA.PCIE_CLK_N
PCIE_CLK_P: CN1.13(REF_CLK+) ; port PCIE_FPGA.PCIE_CLK_P
PCIE_PERST: CN1.22(PERST#) R34.2 ; port PCIE_FPGA.PERST#
PCIE_RX0_N: CN1.23(PERN0) ; port PCIE_FPGA.PCIE_RX0_N
PCIE_RX0_P: CN1.25(PERP0) ; port PCIE_FPGA.PCIE_RX0_P
PCIE_SMB_CLK: CN1.30(SMB_CLK) ; port PCIE_FPGA.PCIE_SMB_CLK
PCIE_SMB_DATA: CN1.32(SMB_DATA) ; port PCIE_FPGA.PCIE_SMB_DATA
PCIE_TX0_N: C42.1 ; port PCIE_FPGA.PCIE_TX0_N
PCIE_TX0_P: C43.1 ; port PCIE_FPGA.PCIE_TX0_P
PCIE_USB_DN: CN1.36(USB_D-) ; port PCIE_FPGA.PCIE_USB_D-
PCIE_USB_DP: CN1.38(USB_D+) ; port PCIE_FPGA.PCIE_USB_D+
PCIE_W_DISABLE: CN1.20(W_DISABLE#) R33.2 ; port PCIE_FPGA.WIFI_DISABLE#
PCIE_WAKE: CN1.1(WAKE#) R32.2 ; port PCIE_FPGA.WAKE#
NetC42_2: C42.2 CN1.31(PETN0)
NetC43_2: C43.2 CN1.33(PETP0)

Not connected (* = marked no-connect by the designer): CN1 3(COEX1) 5(COEX2) 7(CLKREQ#) 8(UIM_PWR) 10(UIM_DATA) 12(UIM_CLK) 14(UIM_RESET) 16(UIM_VPP) 17(UIM_C8_RSV) 19(UIM_C4_RSV) 42(LED_WWAN#) 44(LED_WLAN#) 45(RESERVED) 46(LED_WPAN#) 47(RESERVED) 49(RESERVED) 51(RESERVED)

### Notes on the sheet
- (in symbol MiniPCIe Card) KEY

### Library data of the parts
C39 C40 C44 C45 = C0603C104K3RACTU: Manufacturer Name: Kemet; PackageReference: C0603C104K3RACTU; Manufacturer Part Number: C0603C104K3RACTU
C41 = C0805: Ceramic Chip Capacitor - Standard; Note: Footprint corresponds to dimensions for bulk cassette packaging. This case size has tightened tolerances.; Published: 17-Jul-2002; LatestRevisionDate: 19-Mar-2004; LatestRevisionNote: Silkscreen size reduced.; DatasheetDocument: Mar-2001; PackageDocument: Mar-2001; PackageReference: 0805; Publisher: Altium Limited; Code_JEITA: 0805; Code_IPC: 2012[0805]; ComponentLink1Description: Manufacturer Link; ComponentLink1URL: http://www.kemet.com/; ComponentLink2Description: Datasheet; ComponentLink2URL: http://www.kemet.com/kemet/web/homepage/kechome.nsf/vapubfilesname/F3102TA.pdf/$file/F3102TA.pdf
C42 C43 = C0402: as C1 on sheet FPGA - XC6SLX45T-2CSG324C; Published: 17-Jul-2002; LatestRevisionDate: 19-Mar-2004; LatestRevisionNote: Silkscreen size reduced.; DatasheetDocument: Mar-2001; PackageDocument: Mar-2001; PackageReference: 0402; Publisher: Altium Limited; Code_JEITA: 0402; Code_IPC: 1005 [0402]; ComponentLink1Description: Manufacturer Link; ComponentLink1URL: http://www.kemet.com/; ComponentLink2Description: Datasheet; ComponentLink2URL: http://www.kemet.com/kemet/web/homepage/kechome.nsf/vapubfilesname/F3102TA.pdf/$file/F3102TA.pdf
CN1 = MiniPCIe Card
R32-R34 = Res1: Resistor; Published: 8-Jun-2000; LatestRevisionDate: 17-Jul-2002; LatestRevisionNote: Re-released for DXP Platform.; PackageReference: AXIAL-0.3; Publisher: Altium Limited; PackageDescription: Axial Device, Thru-Hole; 2 Leads; 0.3 in Pin Spacing

## Sheet GPS - NEO-M8T.SchDoc
size A4
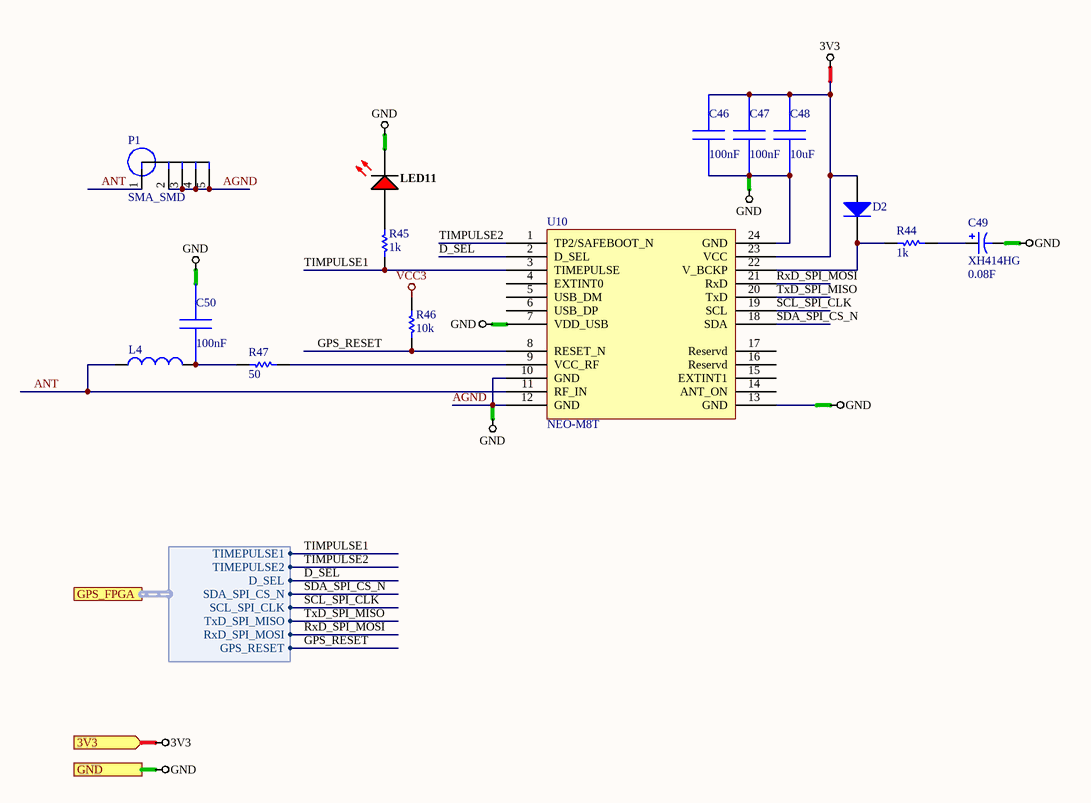
[diagram p9: GPS - NEO-M8T.SchDoc]

### Parts
C46  value 100nF  [C-0603]  (hidden comment: C0603C104K3RACTU)
C47  value 100nF  [C-0603]  (hidden comment: C0603C104K3RACTU)
C48  value 10uF  [1206]  (hidden comment: GRM31CR61E106KA12L)
C49  XH414HG  value 0.08F  [RB7.6-15]
C50  value 100nF  [C-0603]  (hidden comment: C0603C104K3RACTU)
D2  (no value)  [SMC]
L4  (no value)  [0402-A]
LED11  0402-LED-RED  [LED_0402]  (value not drawn)
P1  SMA_SMD  [SMA]
R44  1k  [RESC0402(1005)40_L]
R45  1k  [RESC0402(1005)40_L]
R46  10k  [RESC0402(1005)40_L]
R47  50  [RESC0402(1005)40_L]
U10  NEO-M8T  [NEO]

### Ports
3V3 (in), GND, GPS_FPGA (harness GPS_FPGA)

### Harnesses
GPS_FPGA: TIMEPULSE1, TIMEPULSE2, SDA_SPI_CS_N, SCL_SPI_CLK, TxD_SPI_MISO, RxD_SPI_MOSI, D_SEL, GPS_RESET

### Nets
3V3: C46.1 C47.1 C48.1 D2.1(A) U10.23(VCC) ; port 3V3
AGND: C46.2 C47.2 C48.2 C49.2 C50.1 LED11.2(K) P1.2 P1.3 P1.4 P1.5 U10.7(VDD_USB) U10.10(GND) U10.12(GND) U10.13(GND) U10.24(GND) ; port GND  [also labelled GND]
VCC3: R46.1
ANT: L4.1 P1.1 U10.11(RF_IN)
D_SEL: U10.2(D_SEL) ; port GPS_FPGA.D_SEL
GPS_RESET: R46.2 U10.8(RESET_N) ; port GPS_FPGA.GPS_RESET
RxD_SPI_MOSI: U10.21(RxD) ; port GPS_FPGA.RxD_SPI_MOSI
SCL_SPI_CLK: U10.19(SCL) ; port GPS_FPGA.SCL_SPI_CLK
SDA_SPI_CS_N: U10.18(SDA) ; port GPS_FPGA.SDA_SPI_CS_N
TIMPULSE1: R45.1 U10.3(TIMEPULSE) ; port GPS_FPGA.TIMEPULSE1
TIMPULSE2: U10.1(TP2/SAFEBOOT_N) ; port GPS_FPGA.TIMEPULSE2
TxD_SPI_MISO: U10.20(TxD) ; port GPS_FPGA.TxD_SPI_MISO
NetC49_1: C49.1 R44.2
NetC50_2: C50.2 L4.2 R47.1
NetD2_2: D2.2(K) R44.1 U10.22(V_BCKP)
NetLED11_1: LED11.1(A) R45.2
NetR47_2: R47.2 U10.9(VCC_RF)

Not connected (* = marked no-connect by the designer): U10 4(EXTINT0) 5(USB_DM) 6(USB_DP) 14(ANT_ON) 15(EXTINT1) 16(Reservd) 17(Reservd)

### Library data of the parts
C46 C47 C50 = C0603C104K3RACTU: Manufacturer Name: Kemet; PackageReference: C0603C104K3RACTU; Manufacturer Part Number: C0603C104K3RACTU
C48 = GRM31CR61E106KA12L: GRM31CR61E106KA1; Manufacturer Name: MuRata; PackageReference: GRM31CR61E106KA12L; Manufacturer Part Number: GRM31CR61E106KA12L
C49 = Cap Pol1: Polarized Capacitor (Radial); Published: 8-Jun-2000; LatestRevisionDate: 17-Jul-2002; LatestRevisionNote: Re-released for DXP Platform.; PackageReference: RB7.6-15; Publisher: Altium Limited
D2 = Diode: Default Diode; Published: 8-Jun-2000; LatestRevisionDate: 17-Jul-2002; LatestRevisionNote: Re-released for DXP Platform.; PackageDocument: Sep-1996; PackageReference: SMC; Publisher: Altium Limited; Code_JEDEC: DO-214-AB
L4 = Inductor: Code_IEC: 1005; Published: 8-Jun-2000; LatestRevisionDate: 17-Jul-2002; LatestRevisionNote: Re-released for DXP Platform.; PackageReference: 0402-A; Publisher: Altium Limited; Code_JEITA: 0402
LED11 = LED_RED_A1K2-2: 0402 LED,RED; Manufacturer_PN: LTST-C190KRKT; ID: CMP-0201-0013; DefaultDesignator: LED?; Class: Diodes; Current Average (Io): 1.8V; Sub Class: LED; Reverse Voltage DC (Vr): Red; ComponentLink1Description: Datasheet; ComponentLink1URL: http://optoelectronics.liteon.com/upload/download/DS-22-99-0151/S_110_LTST-C190KRKT.pdf; ComponentLink2Description: Manufacturer; ComponentLink2URL: http://www.liteon.com; Manufacturer Part Number: LTST-C190KRKT
R44 R45 R47 = Res Semi: Semiconductor Resistor; Manufacturer: Generic Components; Class: Passive; Value: 10k; Published: 08/06/2000; Publisher: Altium Hobart Technology Centre; SubClass: Resistor
R46 = Res Semi: Semiconductor Resistor; Manufacturer: Generic Components; Class: Passive; Published: 08/06/2000; Publisher: Altium Hobart Technology Centre; SubClass: Resistor; Value: 10k